# EAGLE design BIRDS_X_APRS_v2.7 (EAGLE 9.6.2)
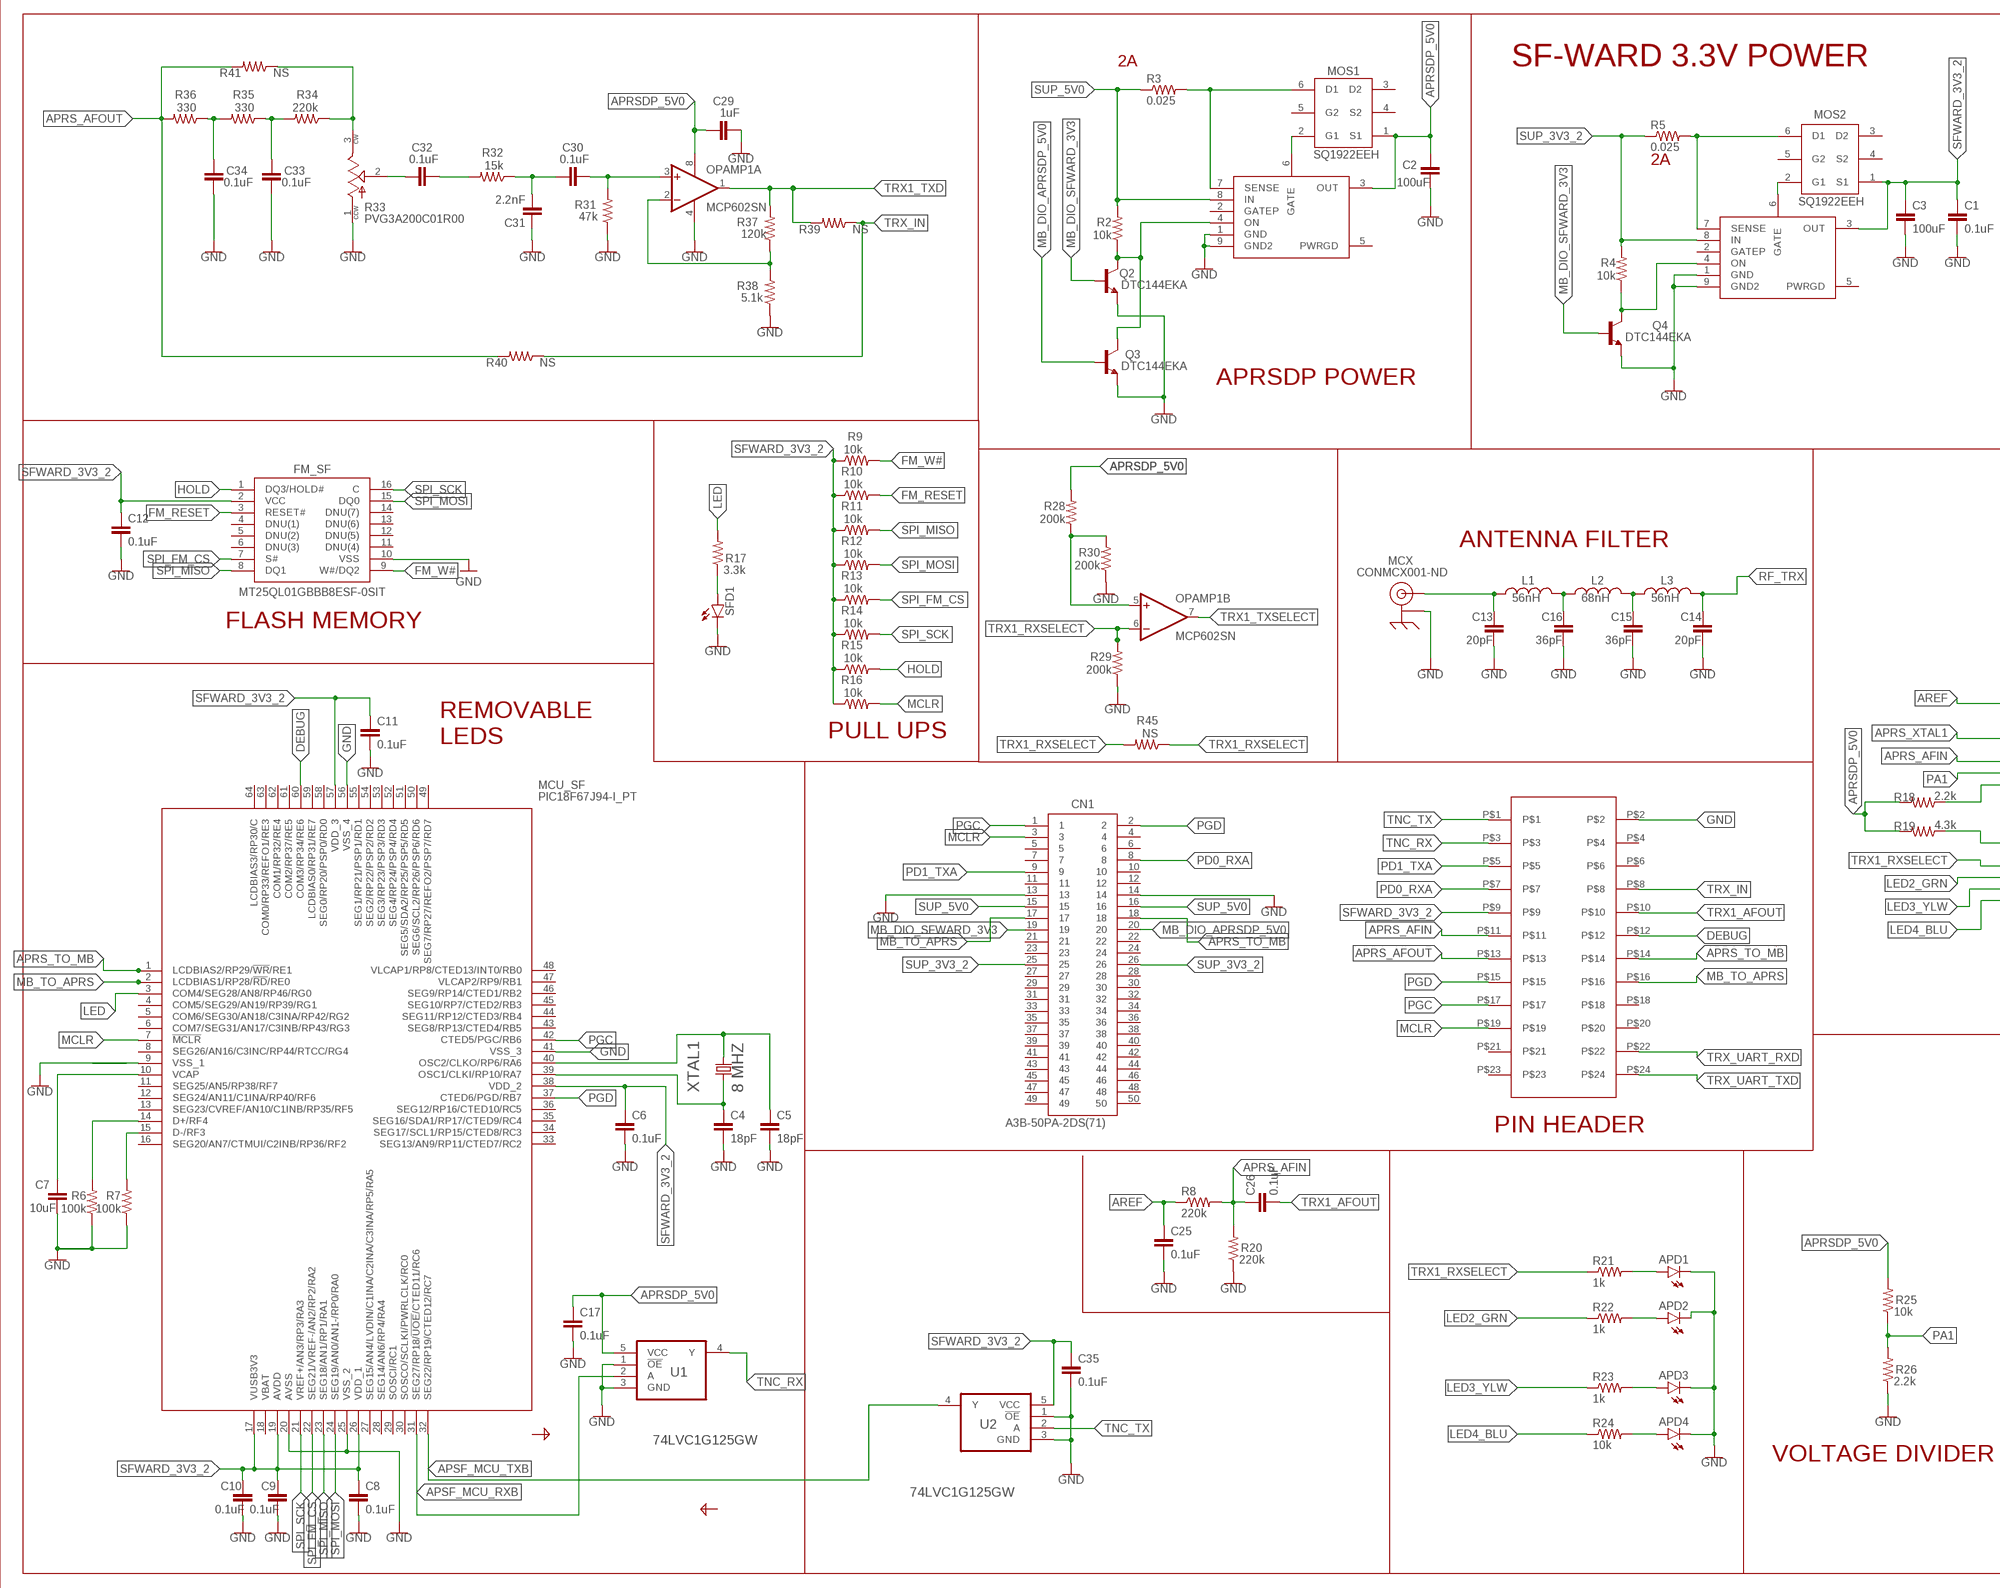
[diagram p0: schematic, sheet 1, part 1 of 2]
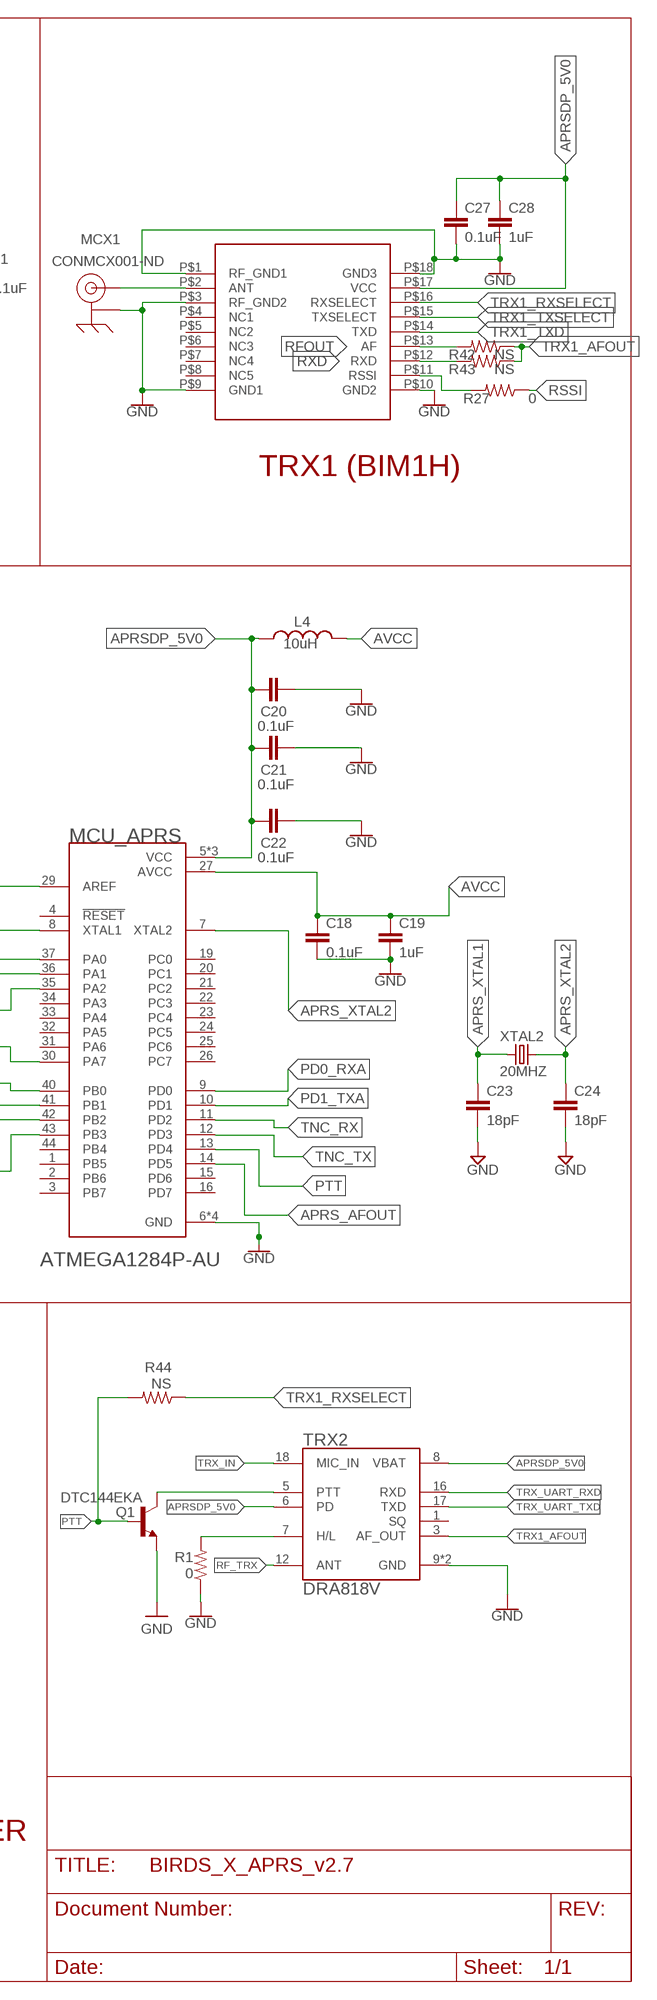
[diagram p1: schematic, sheet 1, part 2 of 2]

## Parts
APD1  LEDSML0603  [SML0603]
APD2  LEDSML0603  [SML0603]
APD3  LEDSML0603  [SML0603]
APD4  LEDSML0603  [SML0603]
C1  0.1uF  CAPACITOR  [M(1005)_US(0402)]
C2  100uF  CAPACITOR2012  [M(2012)_US(0805)]
C3  100uF  CAPACITOR2012  [M(2012)_US(0805)]
C4  18pF  CAPACITOR  [M(1005)_US(0402)]
C5  18pF  CAPACITOR  [M(1005)_US(0402)]
C6  0.1uF  CAPACITOR  [M(1005)_US(0402)]
C7  10uF  CAPACITOR1608  [M(1608)_US(0603)]
C8  0.1uF  CAPACITOR  [M(1005)_US(0402)]
C9  0.1uF  CAPACITOR  [M(1005)_US(0402)]
C10  0.1uF  CAPACITOR  [M(1005)_US(0402)]
C11  0.1uF  CAPACITOR  [M(1005)_US(0402)]
C12  0.1uF  CAPACITOR  [M(1005)_US(0402)]
C13  20pF  CAPACITOR1608  [M(1608)_US(0603)]
C14  20pF  CAPACITOR1608  [M(1608)_US(0603)]
C15  36pF  CAPACITOR1608  [M(1608)_US(0603)]
C16  36pF  CAPACITOR1608  [M(1608)_US(0603)]
C17  0.1uF  CAPACITOR  [M(1005)_US(0402)]
C18  0.1uF  CAPACITOR  [M(1005)_US(0402)]
C19  1uF  CAPACITOR  [M(1005)_US(0402)]
C20  0.1uF  CAPACITOR  [M(1005)_US(0402)]
C21  0.1uF  CAPACITOR  [M(1005)_US(0402)]
C22  0.1uF  CAPACITOR  [M(1005)_US(0402)]
C23  18pF  CAPACITOR  [M(1005)_US(0402)]
C24  18pF  CAPACITOR  [M(1005)_US(0402)]
C25  0.1uF  CAPACITOR  [M(1005)_US(0402)]
C26  0.1uF  CAPACITOR  [M(1005)_US(0402)]
C27  0.1uF  CAPACITOR  [M(1005)_US(0402)]
C28  1uF  CAPACITOR  [M(1005)_US(0402)]
C29  1uF  CAPACITOR  [M(1005)_US(0402)]
C30  0.1uF  CAPACITOR  [M(1005)_US(0402)]
C31  2.2nF  CAPACITOR  [M(1005)_US(0402)]
C32  0.1uF  CAPACITOR  [M(1005)_US(0402)]
C33  0.1uF  CAPACITOR  [M(1005)_US(0402)]
C34  0.1uF  CAPACITOR  [M(1005)_US(0402)]
C35  0.1uF  CAPACITOR  [M(1005)_US(0402)]
CN1  A3B-50PA-2DS(71)  [A3B-50PA-2DS(71)]
FM_SF  MT25QL01GBBB8ESF-0SIT  [SOIC127P1032X265-16N]
JP1  RAB_ACCESS  [RAB_ACCESS]
L1  56nH  INDUCTOR2012  [M(2012)_US(0805)]
L2  68nH  INDUCTOR2012  [M(2012)_US(0805)]
L3  56nH  INDUCTOR2012  [M(2012)_US(0805)]
L4  10uH  INDUCTOR2012  [M(2012)_US(0805)]
MCU_APRS  ATMEGA1284P-AU  [QFP80P1200X1200X120-44N]
MCU_SF  PIC18F67J94-I_PT  [QFP50P1200X1200X120-64N]
MCX  CONMCX001-ND  [CONMCX001-ND]
MCX1  CONMCX001-ND  [CONMCX001-ND]
MOS1  SQ1922EEH  [SOT65P210X110-6N]
MOS2  SQ1922EEH  [SOT65P210X110-6N]
OCP1  BIRDS5_LTC4361  [BIRDS5_LTC4361]
OCP2  BIRDS5_LTC4361  [BIRDS5_LTC4361]
OPAMP1  MCP602SN  [SO08]
Q1  DTC144EKA  [SOT346-R]
Q2  DTC144EKA  [SOT346-R]
Q3  DTC144EKA  [SOT346-R]
Q4  DTC144EKA  [SOT346-R]
R1  0  RESISTOR  [M(1005)_US(0402)]
R2  10k  RESISTOR  [M(1005)_US(0402)]
R3  0.025  RESISTOR2012  [M(2012)_US(0805)]
R4  10k  RESISTOR  [M(1005)_US(0402)]
R5  0.025  RESISTOR2012  [M(2012)_US(0805)]
R6  100k  RESISTOR  [M(1005)_US(0402)]
R7  100k  RESISTOR  [M(1005)_US(0402)]
R8  220k  RESISTOR1608  [M(1608)_US(0603)]
R9  10k  RESISTOR  [M(1005)_US(0402)]
R10  10k  RESISTOR  [M(1005)_US(0402)]
R11  10k  RESISTOR  [M(1005)_US(0402)]
R12  10k  RESISTOR  [M(1005)_US(0402)]
R13  10k  RESISTOR  [M(1005)_US(0402)]
R14  10k  RESISTOR  [M(1005)_US(0402)]
R15  10k  RESISTOR  [M(1005)_US(0402)]
R16  10k  RESISTOR  [M(1005)_US(0402)]
R17  3.3k  RESISTOR1608  [M(1608)_US(0603)]
R18  2.2k  RESISTOR  [M(1005)_US(0402)]
R19  4.3k  RESISTOR  [M(1005)_US(0402)]
R20  220k  RESISTOR1608  [M(1608)_US(0603)]
R21  1k  RESISTOR1608  [M(1608)_US(0603)]
R22  1k  RESISTOR1608  [M(1608)_US(0603)]
R23  1k  RESISTOR1608  [M(1608)_US(0603)]
R24  10k  RESISTOR1608  [M(1608)_US(0603)]
R25  10k  RESISTOR1608  [M(1608)_US(0603)]
R26  2.2k  RESISTOR1608  [M(1608)_US(0603)]
R27  0  RESISTOR1608  [M(1608)_US(0603)]
R28  200k  RESISTOR  [M(1005)_US(0402)]
R29  200k  RESISTOR  [M(1005)_US(0402)]
R30  200k  RESISTOR  [M(1005)_US(0402)]
R31  47k  RESISTOR1608  [M(1608)_US(0603)]
R32  15k  RESISTOR1608  [M(1608)_US(0603)]
R33  PVG3A200C01R00  [TRIM_PVG3A200C01R00]
R34  220k  RESISTOR1608  [M(1608)_US(0603)]
R35  330  RESISTOR1608  [M(1608)_US(0603)]
R36  330  RESISTOR1608  [M(1608)_US(0603)]
R37  120k  RESISTOR1608  [M(1608)_US(0603)]
R38  5.1k  RESISTOR1608  [M(1608)_US(0603)]
R39  NS  RESISTOR1608  [M(1608)_US(0603)]
R40  NS  RESISTOR1608  [M(1608)_US(0603)]
R41  NS  RESISTOR1608  [M(1608)_US(0603)]
R42  NS  RESISTOR1608  [M(1608)_US(0603)]
R43  NS  RESISTOR1608  [M(1608)_US(0603)]
R44  NS  RESISTOR1608  [M(1608)_US(0603)]
R45  NS  RESISTOR1608  [M(1608)_US(0603)]
SFD1  LEDCHIPLED_0603  [CHIPLED_0603]
TRX1  BIM1H  [BIM1H]
TRX2  DRA818V  [DORJI_DRA818V]
U1  74LVC1G125GW  [SOT65P210X110-5N]
U2  74LVC1G125GW  [SOT65P210X110-5N]
XTAL1  8 MHZ  CRYSTAL_CRYSTALSM49  [CRYSTAL_SM49]
XTAL2  20MHZ  CRYSTALSM49  [SM49]

## Nets
APRS_AFIN: C26.1 JP1.P$11 MCU_APRS.37(PA0) R8.2 R20.2
APRS_AFOUT: JP1.P$13 MCU_APRS.14(PD5) R36.2 R40.2 R41.2
APRS_TO_MB: CN1.18 JP1.P$14 MCU_SF.1(LCDBIAS2/RP29/!WR!/RE1)
APRS_XTAL1: C23.1 MCU_APRS.8(XTAL1) XTAL2.1
APRS_XTAL2: C24.1 MCU_APRS.7(XTAL2) XTAL2.2
APRSDP_5V0: C2.1 C17.1 C20.1 C21.1 C22.1 C27.1 C28.1 C29.1 L4.1 MCU_APRS.5(VCC) MCU_APRS.17(VCC) MCU_APRS.38(VCC) MOS1.1(S1) OCP1.3(OUT) OPAMP1.8(P:V+) R18.2 R19.2 R25.2 R28.2 TRX1.P$17(VCC) TRX2.6(PD) TRX2.8(VBAT) U1.5(VCC)
APSF_MCU_RXB: MCU_SF.31(SEG27/RP18/!UOE!/CTED11/RC6) U1.2(A)
APSF_MCU_TXB: MCU_SF.32(SEG22/RP19/CTED12/RC7) U2.4(Y)
AREF: C25.1 MCU_APRS.29(AREF) R8.1
AVCC: C18.1 C19.1 L4.2 MCU_APRS.27(AVCC)
DEBUG: JP1.P$12 MCU_SF.60(COM3/RP34/RE6)
FM_RESET: FM_SF.3(RESET#) R10.2
FM_W#: FM_SF.9(W#/DQ2) R9.2
GATE3: MOS2.2(G1) OCP2.6(GATE)
GND: APD1.C APD2.C APD3.C APD4.C C1.2 C2.2 C3.2 C4.2 C5.2 C6.2 C7.2 C8.2 C9.2 C10.2 C11.2 C12.2 C13.2 C14.2 C15.2 C16.2 C17.2 C18.2 C19.2 C20.2 C21.2 C22.2 C23.2 C24.2 C25.2 C27.2 C28.2 C29.2 C31.1 C33.2 C34.2 C35.2 CN1.13 CN1.14 FM_SF.10(VSS) JP1.P$2 MCU_APRS.6(GND) MCU_APRS.18(GND) MCU_APRS.28(GND) MCU_APRS.39(GND) MCU_SF.9(VSS_1) MCU_SF.20(AVSS) MCU_SF.25(VSS_2) MCU_SF.41(VSS_3) MCU_SF.56(VSS_4) MCX1.2 MCX1.3 MCX1.4 MCX1.5 MCX.2 MCX.3 MCX.4 MCX.5 OCP1.1(GND) OCP1.9(GND2) OCP2.1(GND) OCP2.9(GND2) OPAMP1.4(P:V-) Q1.1(E) Q2.1(E) Q3.1(E) Q4.1(E) R1.1 R20.1 R26.1 R30.1 R31.1 R33.1(CCW) R38.1 TRX1.P$1(RF_GND1) TRX1.P$3(RF_GND2) TRX1.P$9(GND1) TRX1.P$10(GND2) TRX1.P$18(GND3) TRX2.9(GND) TRX2.10(GND) U1.1(!OE) U1.3(GND) U2.1(!OE) U2.3(GND)
HOLD: FM_SF.1(DQ3/HOLD#) R15.2
LED: MCU_SF.3(COM4/SEG28/AN8/RP46/RG0) R17.2
LED2_GREEN: APD2.A R22.2
LED2_GRN: MCU_APRS.41(PB1) R22.1
LED3_YLW: MCU_APRS.42(PB2) R23.1
LED4_BLU: MCU_APRS.43(PB3) R24.1
LED4_BLUE: APD4.A R24.2
LED_3_YELLOW: APD3.A R23.2
MB_DIO_APRSDP_5V0: CN1.20 Q3.2(B)
MB_DIO_SFWARD_3V3: CN1.19 Q2.2(B) Q4.2(B)
MB_TO_APRS: CN1.17 JP1.P$16 MCU_SF.2(LCDBIAS1/RP28/!RD!/RE0)
MCLR: CN1.3 JP1.P$19 MCU_SF.7(!MCLR) R16.2
N$1: MOS1.2(G1) OCP1.6(GATE)
N$2: C7.1 MCU_SF.10(VCAP)
N$3: C5.1 MCU_SF.40(OSC2/CLKO/RP6/RA6) XTAL1.2
N$4: MCU_SF.15(D-/RF3) R7.2
N$5: MCU_SF.14(D+/RF4) R6.2
N$6: R17.1 SFD1.A
N$7: C15.1 L2.2 L3.1
N$8: C16.1 L1.2 L2.1
N$10: C13.1 L1.1 MCX.1
N$12: R1.2 TRX2.7(H/L)
N$13: MCU_APRS.35(PA2) R18.1
N$14: MCU_APRS.30(PA7) R19.1
N$15: R27.2 TRX1.P$11(RSSI)
N$16: MCX1.1 TRX1.P$2(ANT)
N$17: OPAMP1.5(B:+IN) R28.1 R30.2
N$19: C32.2 R32.2
N$20: C30.1 C31.2 R32.1
N$21: C30.2 OPAMP1.3(A:+IN) R31.2
N$22: Q1.3(C) TRX2.5(PTT)
N$23: C32.1 R33.2(WIPER)
N$24: R33.3(CW) R34.1 R41.1
N$25: C34.1 R35.2 R36.1
N$26: C33.1 R34.2 R35.1
N$27: OPAMP1.2(A:-IN) R37.1 R38.2
ON3: OCP2.4(ON) Q4.3(C) R4.1
ON4: OCP1.4(ON) Q2.3(C) Q3.3(C) R2.1
OSC2: C4.1 MCU_SF.39(OSC1/CLKI/RP10/RA7) XTAL1.1
PA1: MCU_APRS.36(PA1) R25.1 R26.2
PD0_RXA: CN1.8 JP1.P$7 MCU_APRS.9(PD0)
PD1_TXA: CN1.9 JP1.P$5 MCU_APRS.10(PD1)
PGC: CN1.1 JP1.P$17 MCU_SF.42(CTED5/PGC/RB6)
PGD: CN1.2 JP1.P$15 MCU_SF.37(CTED6/PGD/RB7)
PTT: MCU_APRS.13(PD4) Q1.2(B) R44.2
RF_TRX: C14.1 L3.2 TRX2.12(ANT)
RFOUT: R42.2 TRX1.P$13(AF)
RSSI: R27.1
RXD: R43.2 TRX1.P$12(RXD)
SENSE3: MOS2.6(D1) OCP2.7(SENSE) R5.2
SENSE4: MOS1.6(D1) OCP1.7(SENSE) R3.2
SFWARD_3V3_2: C1.1 C3.1 C6.1 C8.1 C9.1 C10.1 C11.1 C12.1 C35.1 FM_SF.2(VCC) JP1.P$9 MCU_SF.17(VUSB3V3) MCU_SF.19(AVDD) MCU_SF.26(VDD_1) MCU_SF.38(VDD_2) MCU_SF.57(VDD_3) MOS2.1(S1) OCP2.3(OUT) R9.1 R10.1 R11.1 R12.1 R13.1 R14.1 R15.1 R16.1 U2.5(VCC)
SPI_FM_CS: FM_SF.7(S#) MCU_SF.22(SEG21/VREF-/AN2/RP2/RA2) R13.2
SPI_MISO: FM_SF.8(DQ1) MCU_SF.23(SEG18/AN1/RP1/RA1) R11.2
SPI_MOSI: FM_SF.15(DQ0) MCU_SF.24(SEG19/AN0/AN1-/RP0/RA0) R12.2
SPI_SCK: FM_SF.16(C) MCU_SF.21(VREF+/AN3/RP3/RA3) R14.2
SUP_3V3_2: CN1.25 CN1.26 OCP2.8(IN) R4.2 R5.1
SUP_5V0: CN1.15 CN1.16 OCP1.8(IN) R2.2 R3.1
TNC_RX: JP1.P$3 MCU_APRS.11(PD2) U1.4(Y)
TNC_TX: JP1.P$1 MCU_APRS.12(PD3) U2.2(A)
TRX1_AFOUT: C26.2 JP1.P$10 R42.1 R43.1 TRX2.3(AF_OUT)
TRX1_RX_LED: APD1.A R21.2
TRX1_RXSELECT: MCU_APRS.40(PB0) OPAMP1.6(B:-IN) R21.1 R29.2 R44.1 R45.1 R45.2 TRX1.P$16(RXSELECT)
TRX1_TXD: OPAMP1.1(A:OUT) R37.2 R39.2 TRX1.P$14(TXD)
TRX1_TXSELECT: OPAMP1.7(B:OUT) TRX1.P$15(TXSELECT)
TRX_IN: JP1.P$8 R39.1 R40.1 TRX2.18(MIC_IN)
TRX_UART_RXD: JP1.P$22 TRX2.16(RXD)
TRX_UART_TXD: JP1.P$24 TRX2.17(TXD)
Unconnected: CN1.4 CN1.5 CN1.6 CN1.7 CN1.10 CN1.11 CN1.12 CN1.21 CN1.22 CN1.23 CN1.24 CN1.27 CN1.28 CN1.29 CN1.30 CN1.31 CN1.32 CN1.33 CN1.34 CN1.35 CN1.36 CN1.37 CN1.38 CN1.39 CN1.40 CN1.41 CN1.42 CN1.43 CN1.44 CN1.45 CN1.46 CN1.47 CN1.48 CN1.49 CN1.50 FM_SF.4(DNU(1)) FM_SF.5(DNU(2)) FM_SF.6(DNU(3)) FM_SF.11(DNU(4)) FM_SF.12(DNU(5)) FM_SF.13(DNU(6)) FM_SF.14(DNU(7)) JP1.P$4 JP1.P$6 JP1.P$18 JP1.P$20 JP1.P$21 JP1.P$23 MCU_APRS.1(PB5) MCU_APRS.2(PB6) MCU_APRS.3(PB7) MCU_APRS.4(!RESET) MCU_APRS.15(PD6) MCU_APRS.16(PD7) MCU_APRS.19(PC0) MCU_APRS.20(PC1) MCU_APRS.21(PC2) MCU_APRS.22(PC3) MCU_APRS.23(PC4) MCU_APRS.24(PC5) MCU_APRS.25(PC6) MCU_APRS.26(PC7) MCU_APRS.31(PA6) MCU_APRS.32(PA5) MCU_APRS.33(PA4) MCU_APRS.34(PA3) MCU_APRS.44(PB4) MCU_SF.4(COM5/SEG29/AN19/RP39/RG1) MCU_SF.5(COM6/SEG30/AN18/C3INA/RP42/RG2) MCU_SF.6(COM7/SEG31/AN17/C3INB/RP43/RG3) MCU_SF.8(SEG26/AN16/C3INC/RP44/RTCC/RG4) MCU_SF.11(SEG25/AN5/RP38/RF7) MCU_SF.12(SEG24/AN11/C1INA/RP40/RF6) MCU_SF.13(SEG23/CVREF/AN10/C1INB/RP35/RF5) MCU_SF.16(SEG20/AN7/CTMUI/C2INB/RP36/RF2) MCU_SF.18(VBAT) MCU_SF.27(SEG15/AN4/LVDIN/C1INA/C2INA/C3INA/RP5/RA5) MCU_SF.28(SEG14/AN6/RP4/RA4) MCU_SF.29(SOSCI/RC1) MCU_SF.30(SOSCO/SCLKI/PWRLCLK/RC0) MCU_SF.33(SEG13/AN9/RP11/CTED7/RC2) MCU_SF.34(SEG17/SCL1/RP15/CTED8/RC3) MCU_SF.35(SEG16/SDA1/RP17/CTED9/RC4) MCU_SF.36(SEG12/RP16/CTED10/RC5) MCU_SF.43(SEG8/RP13/CTED4/RB5) MCU_SF.44(SEG11/RP12/CTED3/RB4) MCU_SF.45(SEG10/RP7/CTED2/RB3) MCU_SF.46(SEG9/RP14/CTED1/RB2) MCU_SF.47(VLCAP2/RP9/RB1) MCU_SF.48(VLCAP1/RP8/CTED13/INT0/RB0) MCU_SF.49(SEG7/RP27/REFO2/PSP7/RD7) MCU_SF.50(SEG6/SCL2/RP26/PSP6/RD6) MCU_SF.51(SEG5/SDA2/RP25/PSP5/RD5) MCU_SF.52(SEG4/RP24/PSP4/RD4) MCU_SF.53(SEG3/RP23/PSP3/RD3) MCU_SF.54(SEG2/RP22/PSP2/RD2) MCU_SF.55(SEG1/RP21/PSP1/RD1) MCU_SF.58(SEG0/RP20/PSP0/RD0) MCU_SF.59(LCDBIAS0/RP31/RE7) MCU_SF.61(COM2/RP37/RE5) MCU_SF.62(COM1/RP32/RE4) MCU_SF.63(COM0/RP33/REFO1/RE3) MCU_SF.64(LCDBIAS3/RP30/C) MOS1.3(D2) MOS1.4(S2) MOS1.5(G2) MOS2.3(D2) MOS2.4(S2) MOS2.5(G2) OCP1.2(GATEP) OCP1.5(PWRGD) OCP2.2(GATEP) OCP2.5(PWRGD) R6.1 R7.1 R29.1 SFD1.C TRX1.P$4(NC1) TRX1.P$5(NC2) TRX1.P$6(NC3) TRX1.P$7(NC4) TRX1.P$8(NC5) TRX2.1(SQ)

## Notes on the sheet
- 2A | SF-WARD 3.3V POWER
- 2A
- TRX1 (BIM1H)
- APRSDP POWER
- ANTENNA FILTER
- FLASH MEMORY
- PULL UPS
- REMOVABLE
  LEDS
- PIN HEADER
- VOLTAGE DIVIDER

## Library data of the parts
APD1-APD4 SFD1 = led:LED: LED OSRAM: - CHIPLED LG R971, LG N971, LY N971, LG Q971, LY Q971, LO R971, LY R971 LH N974, LH R974 LS Q976, LO Q976, LY Q976 LO Q996 - Hyper CHIPLED LW Q18S LB Q993, LB Q99A, LB R99A - SideLED LS A670, LO A670, LY A670, LG A670, LP A670 LB A673, LV A673, LT A673, LW A673 LH A674 LY A675 LS A676, LA A676, LO A676, LY A676, LW A676 LS A679, LY A679, LG A679 - Hyper Micro SIDELED® LS Y876, LA Y876, LO Y876, LY Y876 LT Y87S - SmartLED LW L88C, LW L88S LB L89C, LB L89S, LG L890 LS L89K, LO L89K, LY L89K LS L896, LA L896, LO L896, LY L896 - TOPLED LS T670, LO T670, LY T670, LG T670, LP T670 LSG T670, LSP T670, LSY T670, LOP T670, LYG T670 LG T671, LOG T671, LSG T671 LB T673, LV T673, LT T673, LW T673 LH T674 LS T676, LA T676, LO T676, LY T676, LB T676, LH T676, LSB T676, LW T676 LB T67C, LV T67C, LT T67C, LS T67K, LO T67K, LY T67K, LW E67C LS E67B, LA E67B, LO E67B, LY E67B, LB E67C, LV E67C, LT E67C LW T67C LS T679, LY T679, LG T679 LS T770, LO T770, LY T770, LG T770, LP T770 LB T773, LV T773, LT T773, LW T773 LH T774 LS E675, LA E675, LY E675, LS T675 LS T776, LA T776, LO T776, LY T776, LB T776 LHGB T686 LT T68C, LB T68C - Hyper Mini TOPLED® LB M676 - Mini TOPLED Santana® LG M470 LS M47K, LO M47K, LY M47K Source: http://www.osram.convergy.de LUXEON: - LUMILED® LXK2-PW12-R00, LXK2-PW12-S00, LXK2-PW14-U00, LXK2-PW14-V00 LXK2-PM12-R00, LXK2-PM12-S00, LXK2-PM14-U00 LXK2-PE12-Q00, LXK2-PE12-R00, LXK2-PE12-S00, LXK2-PE14-T00, LXK2-PE14-U00 LXK2-PB12-K00, LXK2-PB12-L00, LXK2-PB12-M00, LXK2-PB14-N00, LXK2-PB14-P00, LXK2-PB14-Q00 LXK2-PR12-L00, LXK2-PR12-M00, LXK2-PR14-Q00, LXK2-PR14-R00 LXK2-PD12-Q00, LXK2-PD12-R00, LXK2-PD12-S00 LXK2-PH12-R00, LXK2-PH12-S00 LXK2-PL12-P00, LXK2-PL12-Q00, LXK2-PL12-R00 Source: www.luxeon.com KINGBRIGHT: KA-3528ASYC Source: www.kingbright.com
C1-C35 = Tharindu_lib:CAPACITOR
CN1 = Tharindu1:A3B-50PA-2DS(71)
FM_SF = BIRDS3_CAM_MSN:MT25QL01GBBB8ESF-0SIT: IC FLASH 1GBIT 108MHZ 16SOIC Source: Datasheet <https://www.micron.com/~/media/documents/products/data-sheet/nor-flash/serial-nor/mt25q/die-rev-b/mt25q_qlkt_l_01g_bbb_0.pdf>; DESCRIPTION: IC FLASH 1GBIT 108MHZ 16SOIC; HEIGHT: 2.65mm; MANUFACTURER_NAME: Micron; MANUFACTURER_PART_NUMBER: MT25QL01GBBB8ESF-0SIT; SUPPLIER_NAME: RS
JP1 = BIRDS_4_general_components_library:RAB_ACCESS
L1-L4 = Tharindu_lib:INDUCTOR
MCU_APRS = ATMEGA1284P-AU:ATMEGA1284P-AU: ATmega Series 20 MHz 128 KB Flash 16 KB SRAM 8-Bit Microcontroller - TQFP-44 Check availability <https://pricing.snapeda.com/parts/ATMEGA1284P-AU/Microchip/view-part?ref=eda>; AVAILABILITY: In Stock; DESCRIPTION: AVR AVR® ATmega Microcontroller IC 8-Bit 20MHz 128KB (64K x 16) FLASH 44-TQFP (10x10); MF: Microchip; MP: ATMEGA1284P-AU; PACKAGE: TQFP-44 Microchip; PRICE: None; PURCHASE-URL: https://pricing.snapeda.com/search/part/ATMEGA1284P-AU/?ref=eda
MCU_SF = PIC18F67J94-I_PT:PIC18F67J94-I_PT: MCU 8-Bit 128K Flash LCD USB XLP TQFP64 Microchip PIC18F67J94-I/PT, 8bit PIC Microcontroller, 64MHz, 128 kB Flash, 64-Pin TQFP Source: Datasheet <http://uk.rs-online.com/web/p/products/8233908>; ALLIED_NUMBER: 70470236; ALLIED_PRICE-STOCK: https://www.alliedelec.com/microchip-technology-inc-pic18f67j94-i-pt/70470236/; DESCRIPTION: MCU 8-Bit 128K Flash LCD USB XLP TQFP64 Microchip PIC18F67J94-I/PT, 8bit PIC Microcontroller, 64MHz, 128 kB Flash, 64-Pin TQFP; HEIGHT: 1.2mm; MANUFACTURER_NAME: Microchip; MANUFACTURER_PART_NUMBER: PIC18F67J94-I/PT; MOUSER_PART_NUMBER: 579-PIC18F67J94-I/PT; MOUSER_PRICE-STOCK: https://www.mouser.com/Search/Refine.aspx?Keyword=579-PIC18F67J94-I%2FPT; RS_PART_NUMBER: 1652172; RS_PRICE-STOCK: http://uk.rs-online.com/web/p/products/1652172
MCX MCX1 = Tharindu:CONMCX001-ND
MOS1 MOS2 = BIRDS3_CAM_MSN:SQ1922EEH
OCP1 OCP2 = BIRDS5_LTC4361:BIRDS5_LTC4361
OPAMP1 = linear:MCP602: Single Op Amp 2.7V to 6.0V Single Supply CMOS Source: http://ww1.microchip.com/downloads/en/DeviceDoc/21314g.pdf
Q1-Q4 = BIRDS3_CAM_MSN:DTC144EKA
R1-R32 R34-R45 = Tharindu_lib:RESISTOR
R33 = PVG3A200C01R00:PVG3A200C01R00: Res Cermet Trimmer 20 Ohm 20% 1/4W 1(Elec)/1(Mech)Turn 2.2mm (3.6 X 3.6 X 2mm) J-Hook SMD T/R; DESCRIPTION: Trimmer 20 Ohm 0.25w Smd; DIGI-KEY_PART_NUMBER: 490-2647-1-ND; DIGI-KEY_PURCHASE_URL: https://www.digikey.jp/product-detail/en/bourns-inc/PVG3A200C01R00/490-2647-1-ND/666223?utm_source=snapeda&utm_medium=aggregator&utm_campaign=symbol; MF: Bourns; MP: PVG3A200C01R00; PACKAGE: TO-221 Bourns
TRX1 = BIRDS_4_general_components_library:BIM1H
TRX2 = DRA818V:DRA818V: VHF Band Voice Transceiver Module Check availability <https://pricing.snapeda.com/parts/DRA818V/DORJI/view-part?ref=eda>; AVAILABILITY: Not in stock; MF: DORJI; MP: DRA818V; PACKAGE: Package; PRICE: None
U1 U2 = 74LVC1G125GW(1):74LVC1G125GW: Bus buffer/line driver 3-state Check availability <https://pricing.snapeda.com/parts/74LVC1G125GW/NXP%20Semiconductors/view-part?ref=eda>; AVAILABILITY: Not in stock; CHECK_PRICES: https://www.snapeda.com/parts/74LVC1G125GW/NXP+Semiconductors/view-part/?ref=eda; DESCRIPTION: Buffer, Non-Inverting 1 Element 1 Bit per Element 3-State Output 5-TSSOP; MF: NXP Semiconductors; MP: 74LVC1G125GW; PACKAGE: SOT-353 NXP Semiconductors; PRICE: None; SNAPEDA_LINK: https://www.snapeda.com/parts/74LVC1G125GW/NXP+Semiconductors/view-part/?ref=snap
XTAL1 = Schematic SF FM v1.26:CRYSTAL_CRYSTAL: CRYSTAL; OC_FARNELL: unknown; OC_NEWARK: unknown
XTAL2 = crystal:CRYSTAL: CRYSTAL; OC_FARNELL: unknown; OC_NEWARK: unknown

## Board
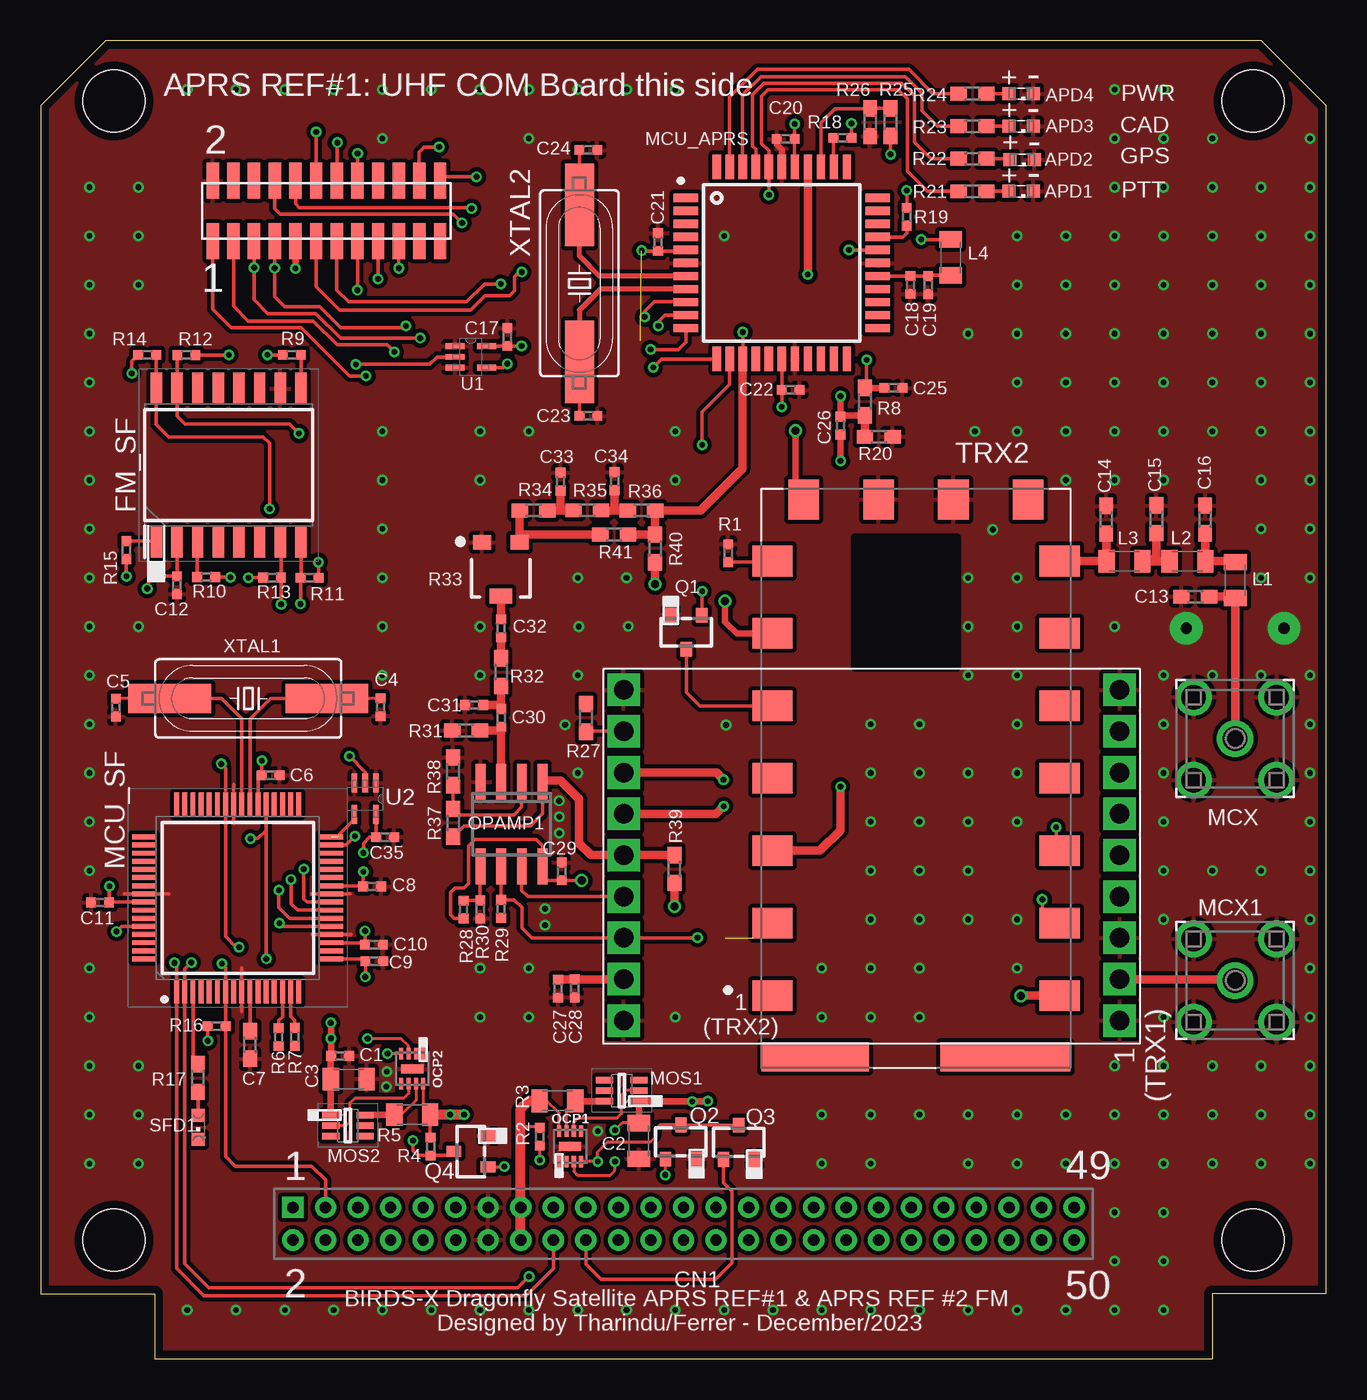
[diagram p2: board, top side]
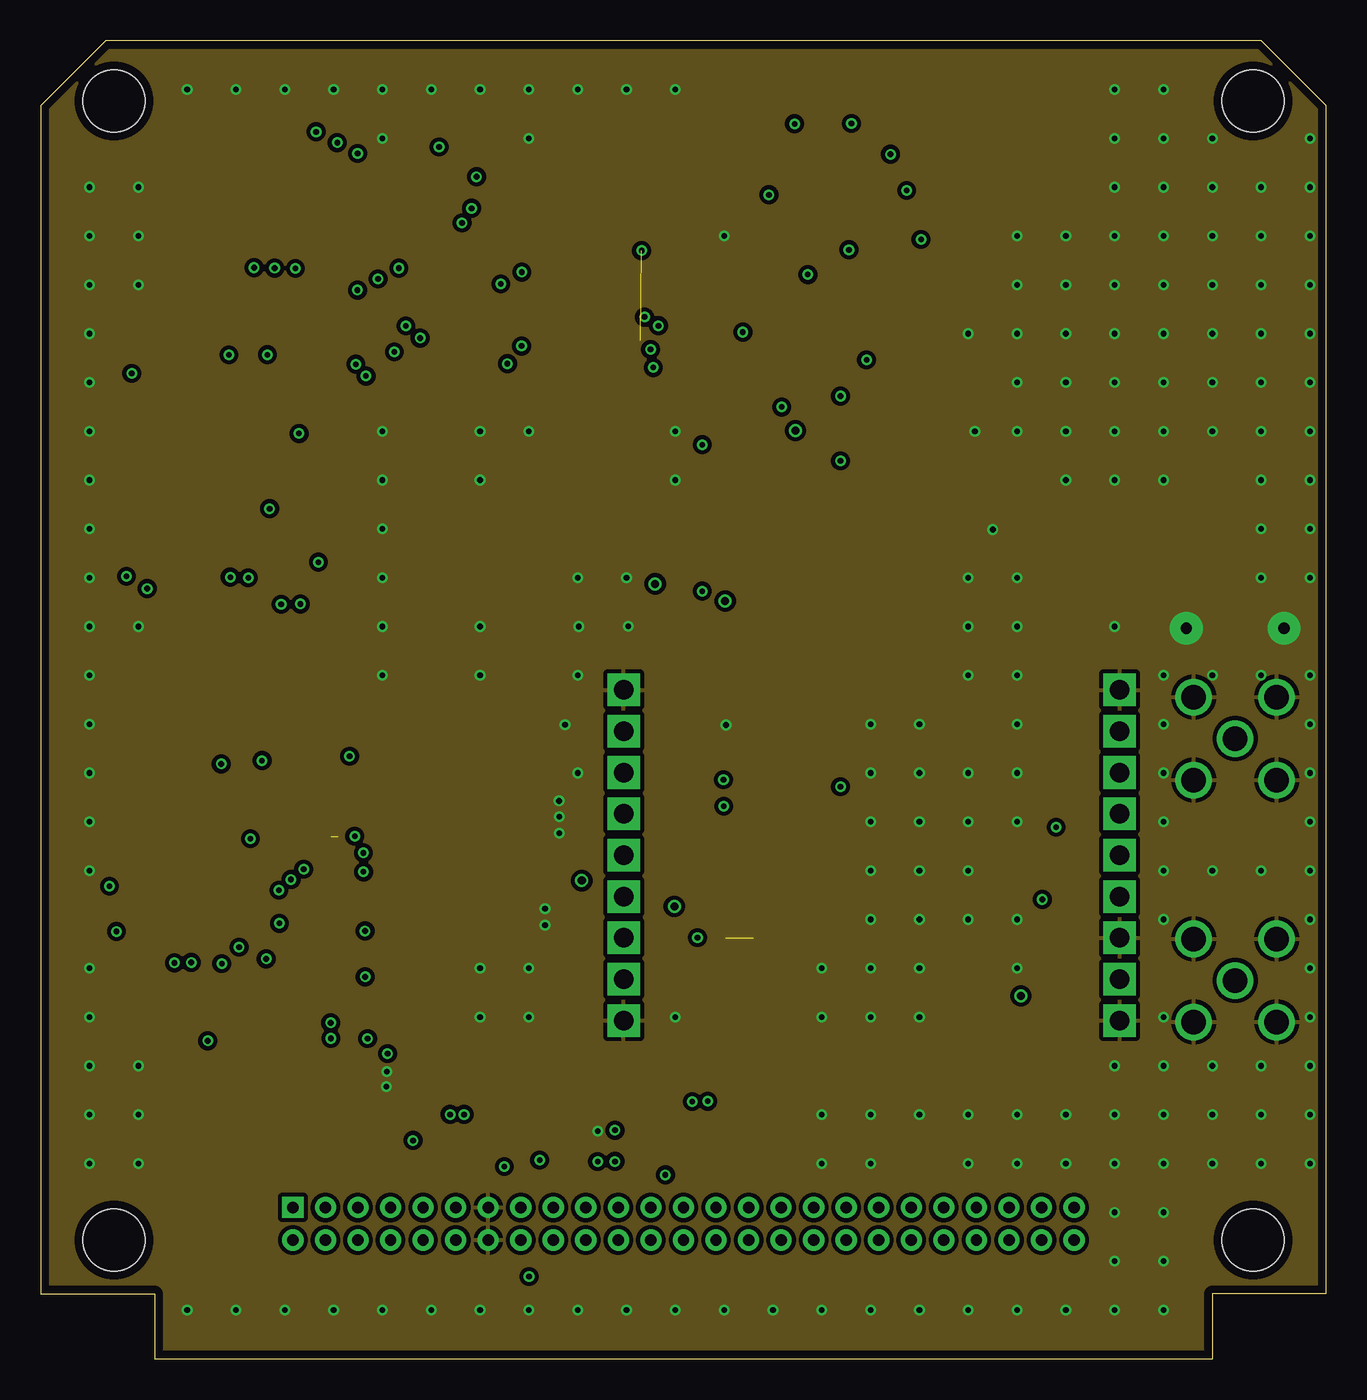
[diagram p3: board, inner layer Route2]
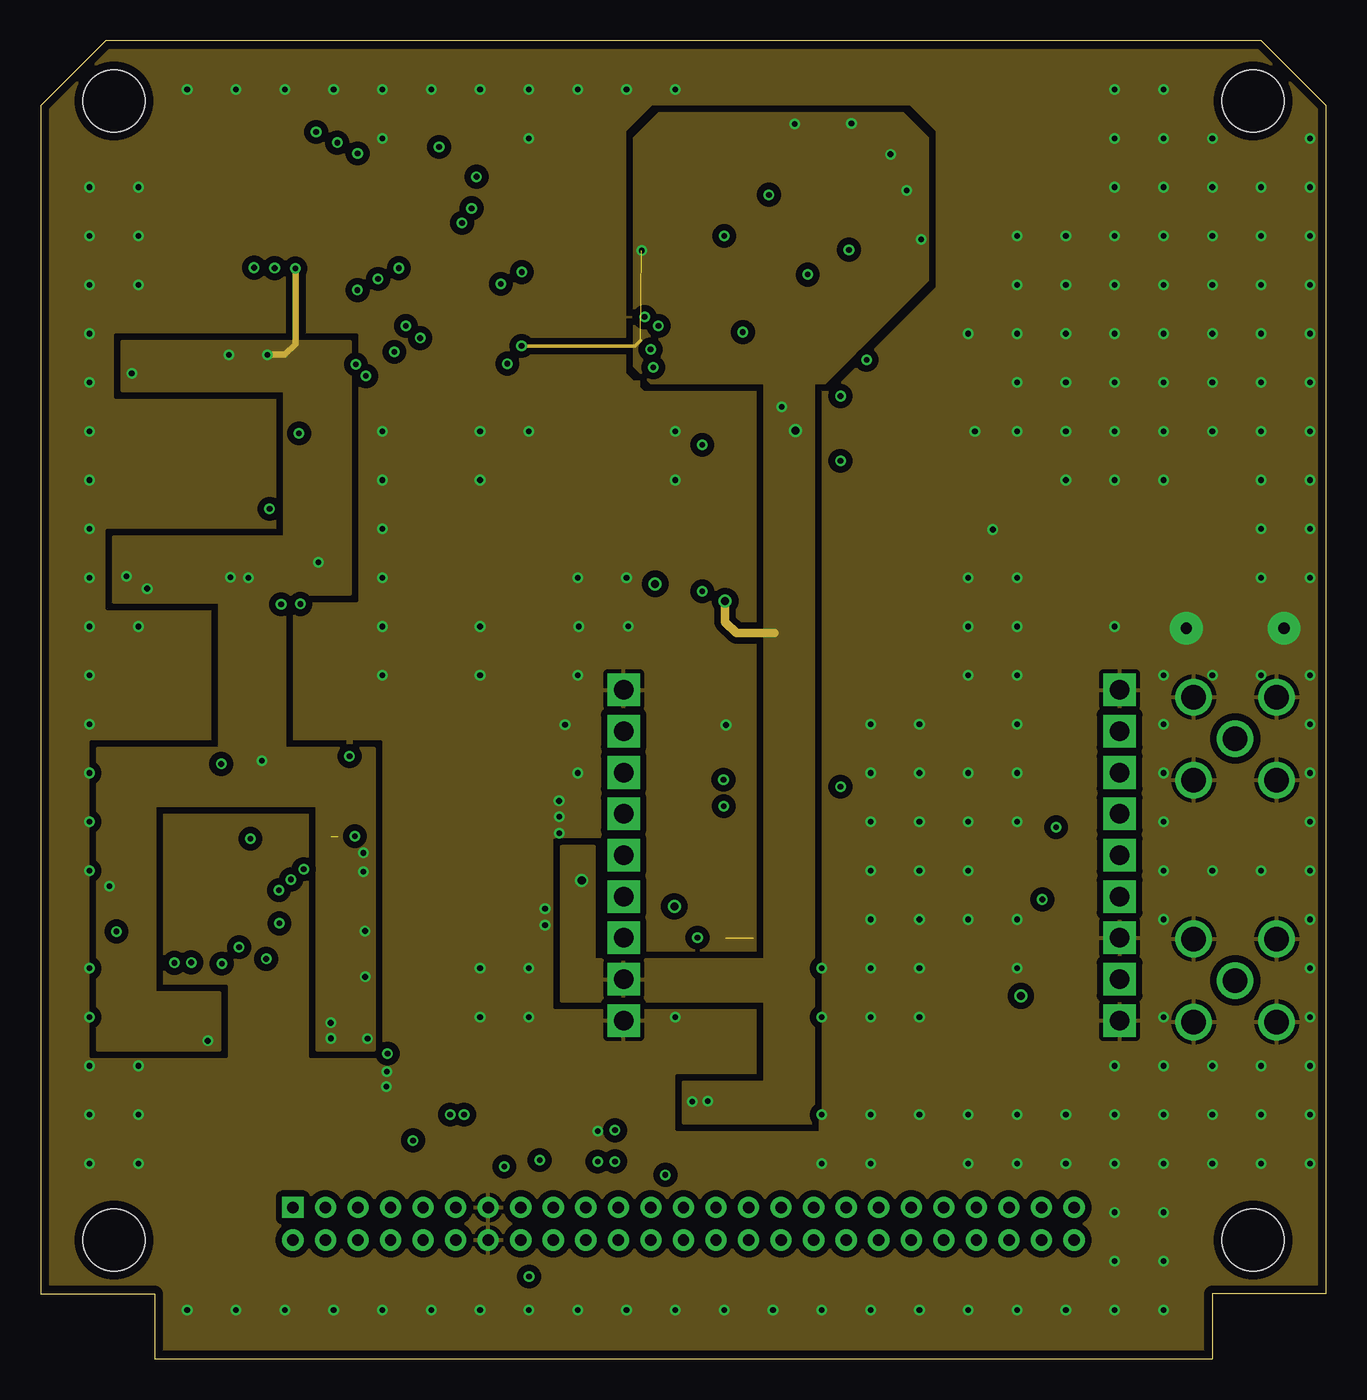
[diagram p4: board, inner layer Route15]
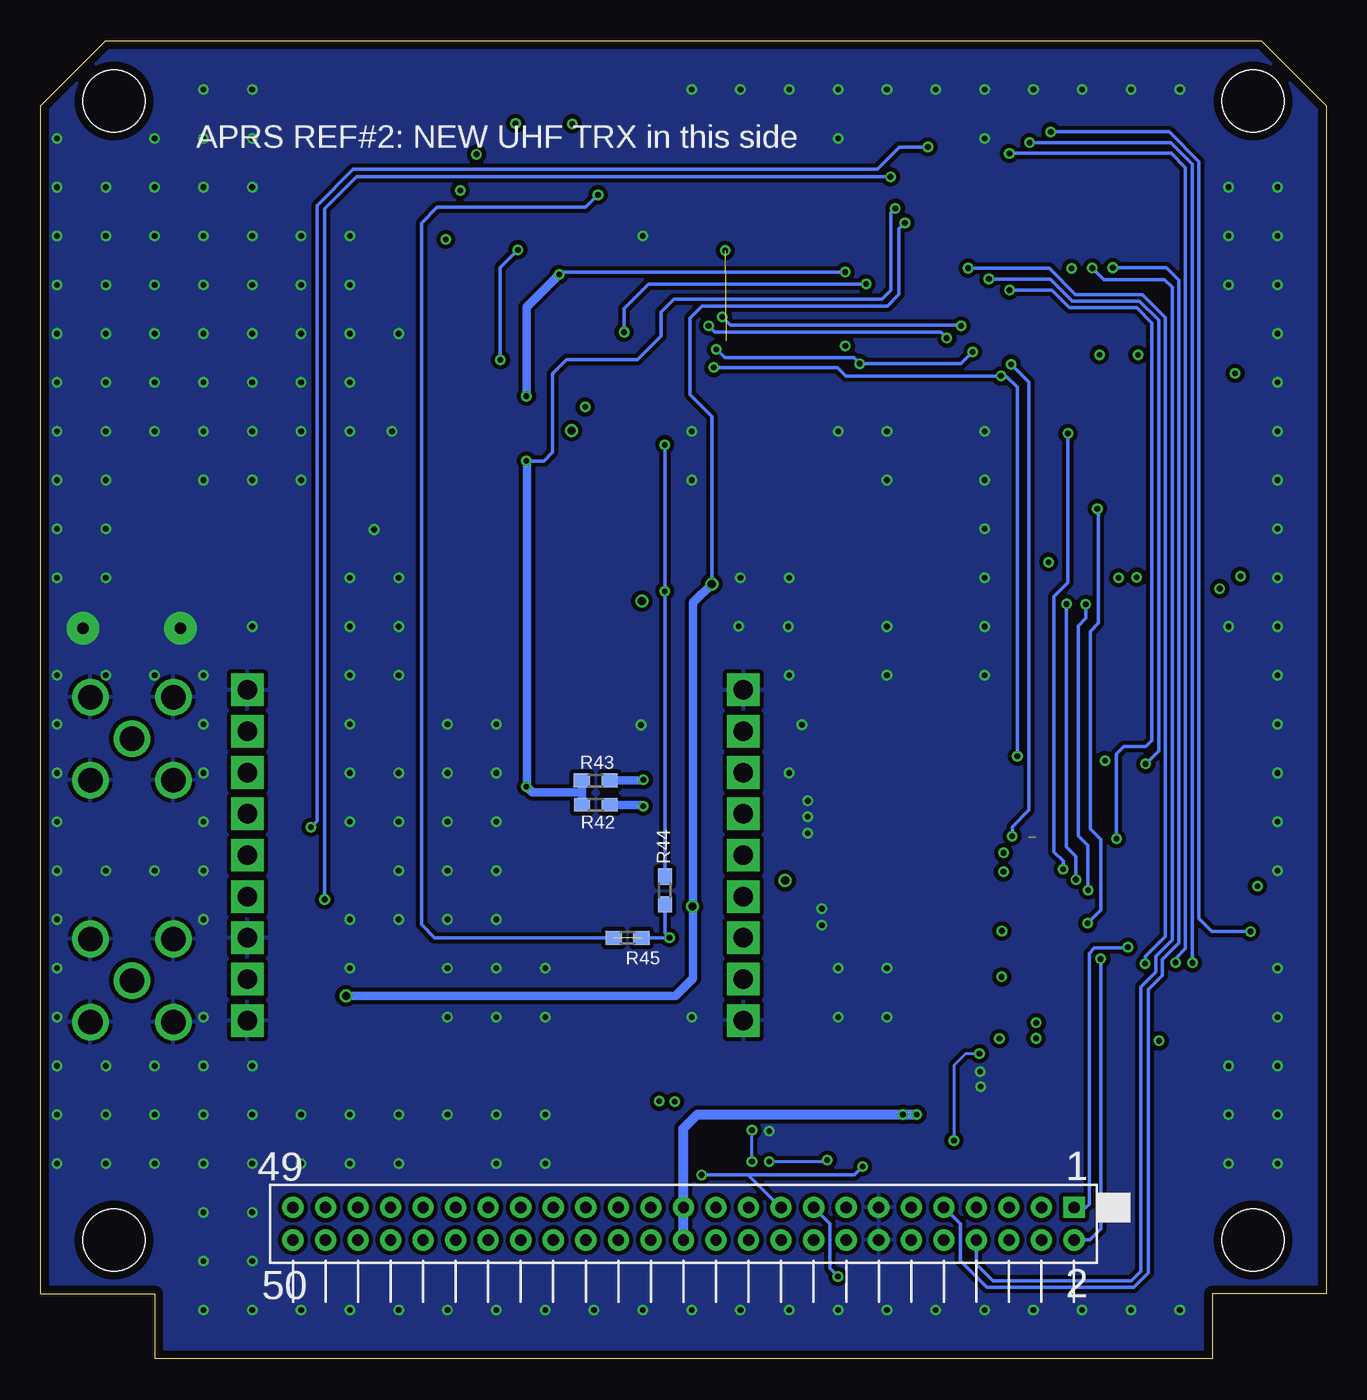
[diagram p5: board, bottom side, seen from below]

Size 79 x 81 mm. Coordinates in mm from the lower left corner, seen from the top.
Outline: 7,0 72,0 72,4 79,4 79,77 75,81 4,81 0,77 0,4 7,4 7,0
Copper layers (1+2*15+16): Top 0.018mm / dielectric 0.25mm / Route2 0.035mm / dielectric 1mm / Route15 0.035mm / dielectric 0.25mm / Bottom 0.018mm
Design rules "default": minimum track width 5mil, minimum drill 0.3mm, track to track 5mil, track to pad 0.229mm, pad to pad 5mil, via to via 5mil, smd to smd 5mil, copper to edge 0.5mm, drill to drill 0.5mm, minimum pad ring 0.15mm, minimum via ring 0.15mm, stop-mask expansion 4mil, vias tented up to drill 0.35mm, thermal gap 10mil
Holes 3.8 mm at 4.5,7.3 74.5,7.3 74.5,77.3 4.5,77.3

### Footprints (pad centres in the part's own frame; a part is rotated, then mirrored left to right if it is on the bottom)
SML0603 = smd 0.8 x 0.8: A 0.75,0; C -0.75,0
M(1005)_US(0402) = smd 0.6 x 0.6: 1 -0.55,0; 2 0.55,0
M(2012)_US(0805) = smd 1 x 1.4: 1 -1.1,0; 2 1.1,0
M(1608)_US(0603) = smd 1 x 0.85: 1 -0.85,0; 2 0.85,0
A3B-50PA-2DS(71) = drill 0.7 pad 1.3 square: 1 0,2 | drill 0.7 pad 1.3: 2 0,0; 3 2,2; 4 2,0; 5 4,2; 6 4,0; 7 6,2; 8 6,0; 9 8,2; 10 8,0; 11 10,2; 12 10,0; 13 12,2; 14 12,0; 15 14,2; 16 14,0; 17 16,2; 18 16,0; 19 18,2; 20 18,0; 21 20,2; 22 20,0; 23 22,2; 24 22,0; 25 24,2; 26 24,0; 27 26,2; 28 26,0; 29 28,2; 30 28,0; 31 30,2; 32 30,0; 33 32,2; 34 32,0; 35 34,2; 36 34,0; 37 36,2; 38 36,0; 39 38,2; 40 38,0; 41 40,2; 42 40,0; 43 42,2; 44 42,0; 45 44,2; 46 44,0; 47 46,2; 48 46,0; 49 48,2; 50 48,0
SOIC127P1032X265-16N = smd 1.925 x 0.7: 1 -4.712,4.445; 2 -4.712,3.175; 3 -4.712,1.905; 4 -4.712,0.635; 5 -4.712,-0.635; 6 -4.712,-1.905; 7 -4.712,-3.175; 8 -4.712,-4.445; 9 4.712,-4.445; 10 4.712,-3.175; 11 4.712,-1.905; 12 4.712,-0.635; 13 4.712,0.635; 14 4.712,1.905; 15 4.712,3.175; 16 4.712,4.445
RAB_ACCESS = smd 2.2 x 0.76: P$1 -0.15,-0.635; P$2 3.55,-0.635; P$3 -0.15,-1.905; P$4 3.55,-1.905; P$5 -0.15,-3.175; P$6 3.55,-3.175; P$7 -0.15,-4.445; P$8 3.55,-4.445; P$9 -0.15,-5.715; P$10 3.55,-5.715; P$11 -0.15,-6.985; P$12 3.55,-6.985; P$13 -0.15,-8.255; P$14 3.55,-8.255; P$15 -0.15,-9.525; P$16 3.55,-9.525; P$17 -0.15,-10.795; P$18 3.55,-10.795; P$19 -0.15,-12.065; P$20 3.55,-12.065; P$21 -0.15,-13.335; P$22 3.55,-13.335; P$23 -0.15,-14.605; P$24 3.55,-14.605
QFP80P1200X1200X120-44N = smd 1.5 x 0.5: 1 -5.9,4; 2 -5.9,3.2; 3 -5.9,2.4; 4 -5.9,1.6; 5 -5.9,0.8; 6 -5.9,0; 7 -5.9,-0.8; 8 -5.9,-1.6; 9 -5.9,-2.4; 10 -5.9,-3.2; 11 -5.9,-4; 23 5.9,-4; 24 5.9,-3.2; 25 5.9,-2.4; 26 5.9,-1.6; 27 5.9,-0.8; 28 5.9,0; 29 5.9,0.8; 30 5.9,1.6; 31 5.9,2.4; 32 5.9,3.2; 33 5.9,4 | smd 0.5 x 1.5: 12 -4,-5.9; 13 -3.2,-5.9; 14 -2.4,-5.9; 15 -1.6,-5.9; 16 -0.8,-5.9; 17 0,-5.9; 18 0.8,-5.9; 19 1.6,-5.9; 20 2.4,-5.9; 21 3.2,-5.9; 22 4,-5.9; 34 4,5.9; 35 3.2,5.9; 36 2.4,5.9; 37 1.6,5.9; 38 0.8,5.9; 39 0,5.9; 40 -0.8,5.9; 41 -1.6,5.9; 42 -2.4,5.9; 43 -3.2,5.9; 44 -4,5.9
QFP50P1200X1200X120-64N = smd 1.475 x 0.3: 1 -5.738,3.75; 2 -5.738,3.25; 3 -5.738,2.75; 4 -5.738,2.25; 5 -5.738,1.75; 6 -5.738,1.25; 7 -5.738,0.75; 8 -5.738,0.25; 9 -5.738,-0.25; 10 -5.738,-0.75; 11 -5.738,-1.25; 12 -5.738,-1.75; 13 -5.738,-2.25; 14 -5.738,-2.75; 15 -5.738,-3.25; 16 -5.738,-3.75; 33 5.738,-3.75; 34 5.738,-3.25; 35 5.738,-2.75; 36 5.738,-2.25; 37 5.738,-1.75; 38 5.738,-1.25; 39 5.738,-0.75; 40 5.738,-0.25; 41 5.738,0.25; 42 5.738,0.75; 43 5.738,1.25; 44 5.738,1.75; 45 5.738,2.25; 46 5.738,2.75; 47 5.738,3.25; 48 5.738,3.75 | smd 0.3 x 1.475: 17 -3.75,-5.738; 18 -3.25,-5.738; 19 -2.75,-5.738; 20 -2.25,-5.738; 21 -1.75,-5.738; 22 -1.25,-5.738; 23 -0.75,-5.738; 24 -0.25,-5.738; 25 0.25,-5.738; 26 0.75,-5.738; 27 1.25,-5.738; 28 1.75,-5.738; 29 2.25,-5.738; 30 2.75,-5.738; 31 3.25,-5.738; 32 3.75,-5.738; 49 3.75,5.738; 50 3.25,5.738; 51 2.75,5.738; 52 2.25,5.738; 53 1.75,5.738; 54 1.25,5.738; 55 0.75,5.738; 56 0.25,5.738; 57 -0.25,5.738; 58 -0.75,5.738; 59 -1.25,5.738; 60 -1.75,5.738; 61 -2.25,5.738; 62 -2.75,5.738; 63 -3.25,5.738; 64 -3.75,5.738
CONMCX001-ND = drill 1.5: 1 0,0; 2 -2.55,-2.55; 3 2.55,-2.55; 4 2.55,2.55; 5 -2.55,2.55
SOT65P210X110-6N = smd 1.05 x 0.4: 1 -1.05,0.65; 2 -1.05,0; 3 -1.05,-0.65; 4 1.05,-0.65; 5 1.05,0; 6 1.05,0.65
BIRDS5_LTC4361 = smd 0.25 x 0.7: 1 -0.675,-0.925; 2 -0.225,-0.925; 3 0.225,-0.925; 4 0.675,-0.925; 5 0.675,0.925; 6 0.225,0.925; 7 -0.225,0.925; 8 -0.675,0.925 | smd 1.37 x 0.54: 9 0,0
SO08 = smd 0.6 x 2.2: 1 -1.905,-2.6; 2 -0.635,-2.6; 3 0.635,-2.6; 4 1.905,-2.6; 5 1.905,2.6; 6 0.635,2.6; 7 -0.635,2.6; 8 -1.905,2.6
SOT346-R = smd 0.7 x 0.9: 1 0.95,-1.05; 2 -0.95,-1.05; 3 0,1.05
TRIM_PVG3A200C01R00 = smd 1.1 x 0.9: 1 1.15,-1.65; 3 -1.15,-1.65 | smd 1.4 x 0.9: 2 0,1.65
CHIPLED_0603 = smd 0.8 x 0.8: A 0,-0.75; C 0,0.75
BIM1H = drill 1.2 pad 2 square: P$1 1.27,21.59; P$2 1.27,19.05; P$3 1.27,16.51; P$4 1.27,13.97; P$5 1.27,11.43; P$6 1.27,8.89; P$7 1.27,6.35; P$8 1.27,3.81; P$9 1.27,1.27; P$10 31.75,1.27; P$11 31.75,3.81; P$12 31.75,6.35; P$13 31.75,8.89; P$14 31.75,11.43; P$15 31.75,13.97; P$16 31.75,16.51; P$17 31.75,19.05; P$18 31.75,21.59
DORJI_DRA818V = smd 1.88 x 2.47: 1 -13.35,8.825; 2 -8.9,8.825; 3 -4.45,8.825; 4 0,8.825; 5 4.45,8.825; 6 8.9,8.825; 7 13.35,8.825; 12 13.35,-8.825; 13 8.9,-8.825; 14 4.45,-8.825; 15 0,-8.825; 16 -4.45,-8.825; 17 -8.9,-8.825; 18 -13.35,-8.825 | smd 2.47 x 1.88: 8 17.125,6.9; 9 17.125,2.3; 10 17.125,-2.3; 11 17.125,-6.9 | smd 1.8 x 6.6: P2 -17.125,6.2 | smd 1.8 x 8: P3 -17.125,-5.5
SOT65P210X110-5N = smd 1.168 x 0.356: 1 -0.965,0.66; 2 -0.965,0; 3 -0.965,-0.66; 4 0.965,-0.66; 5 0.965,0.66
CRYSTAL_SM49 = smd 5.08 x 1.778: 1 -4.826,0; 2 4.826,0
SM49 = smd 5.08 x 1.778: 1 -4.826,0; 2 4.826,0

### Placement (x,y rotation side)
APD1  60.26,71.74 180 top
APD2  60.3,73.68 180 top
APD3  60.26,75.74 180 top
APD4  60.26,77.74 180 top
C1  18.4,18.62 0 top
C2  36.76,13.39 270 top
C3  18.93,17.19 0 top
C4  20.89,40.04 270 top
C5  4.62,40.01 270 top
C6  14.13,35.86 0 top
C7  12.87,19.29 270 top
C8  20.37,29.03 0 top
C9  20.5,24.44 0 top
C10  20.48,25.45 0 top
C11  3.65,28.04 180 top
C12  8.38,47.54 270 top
C13  70.95,46.83 180 top
C14  65.47,51.56 90 top
C15  68.56,51.59 90 top
C16  71.56,51.58 90 top
C17  28.68,62.79 90 top
C18  53.44,65.99 270 top
C19  54.53,65.98 270 top
C20  45.78,74.96 180 top
C21  37.94,68.63 90 top
C22  46.08,59.54 0 top
C23  33.66,57.94 0 top
C24  33.65,74.28 0 top
C25  52.4,59.66 0 top
C26  49.15,57.35 270 top
C27  31.79,22.75 270 top
C28  32.82,22.76 270 top
C29  32.02,29.96 90 top
C30  28.31,39.39 270 top
C31  26.63,40.18 0 top
C32  28.29,44.89 270 top
C33  31.95,53.91 90 top
C34  35.27,53.94 90 top
C35  21.17,32.06 0 top
CN1  15.5,7.3 0 top
FM_SF  11.55,54.92 90 top
JP1  9.94,68.84 90 top
L1  73.41,47.86 90 top
L2  70.46,49.01 180 top
L3  66.6,49 180 top
L4  55.92,67.68 270 top
MCU_APRS  45.54,67.34 0 top
MCU_SF  12.11,28.32 90 top
MCX  73.4,38.11 90 top
MCX1  73.4,23.25 0 top
MOS1  35.71,16.48 180 top
MOS2  18.88,14.33 0 top
OCP1  32.53,13.06 0 top
OCP2  22.83,17.83 180 top
OPAMP1  28.93,32.85 180 top
Q1  39.68,44.65 180 top
Q2  39.35,13.33 0 top
Q3  42.91,13.31 0 top
Q4  26.44,12.75 90 top
R1  42.25,49.51 270 top
R2  30.67,13.65 90 top
R3  31.76,15.86 0 top
R4  23.97,13.04 90 top
R5  22.83,15.01 180 top
R6  14.63,19.77 90 top
R7  15.62,19.78 90 top
R8  50.65,58.82 270 top
R9  15.44,61.69 0 top
R10  10.17,48.04 180 top
R11  16.53,48 180 top
R12  8.96,61.69 180 top
R13  14.21,48 0 top
R14  6.55,61.7 0 top
R15  5.26,49.7 90 top
R16  10.81,20.44 0 top
R17  9.67,17.25 90 top
R18  49.27,75.03 0 top
R19  53.22,70.18 90 top
R20  51.5,56.66 180 top
R21  57.26,71.74 0 top
R22  57.26,73.74 0 top
R23  57.26,75.74 0 top
R24  57.26,77.74 0 top
R25  52.22,75.99 270 top
R26  50.97,75.98 90 top
R27  33.51,39.39 270 top
R28  25.99,27.61 270 top
R29  28.29,27.65 90 top
R30  27.01,27.62 90 top
R31  26.14,38.61 0 top
R32  28.3,42.2 90 top
R33  28.28,48.52 180 top
R34  30.29,52.13 0 top
R35  33.59,52.14 0 top
R36  36.92,52.13 0 top
R37  25.35,32.94 270 top
R38  25.34,36.1 270 top
R39  38.94,30.1 90 top
R40  37.76,49.8 90 top
R41  35.24,50.65 0 top
R42  44.89,34.05 0 bottom
R43  44.9,35.53 0 bottom
R44  40.64,28.77 90 bottom
R45  42.94,25.87 180 bottom
SFD1  9.68,14.22 180 top
TRX1  67.57,42.38 180 top
TRX2  53.79,35.67 90 top
U1  26.43,61.57 0 top
U2  19.94,34.42 270 top
XTAL1  12.76,40.58 180 top
XTAL2  33.11,66.09 90 top

### Tracks (layer width: path | path; a pad name or v marks a point on that pad's centre or on a via)
APRS_AFIN  (via drill 0.35)
  Top 0.203: JP1.P$11 16.92,65.89 18.37,64.44 26.43,64.44 27.32,65.33 28.82,65.33 29.12,65.63 29.12,66.49 29.41,66.78 v29.57,66.78
  Top 0.406: 49.15,59.14 C26.1 49.22,57.97 R8.2
  Top 0.508: v49.15,59.16 v49.16,59.15 49.15,59.14 | MCU_APRS.37 v47.14,66.63 | R8.2 R20.2
  Bottom 0.203: v47.14,66.63 46.99,66.78 v29.57,66.78
  Bottom 0.508: v49.15,59.16 49.15,64.63 v47.15,66.63 v47.14,66.63
APRS_AFOUT  (via drill 0.35)
  Top 0.203: JP1.P$13 18.19,65.67 18.91,64.95 26.18,64.95 27.28,66.05 v28.28,66.05 | v43.15,63.09 MCU_APRS.14
  Top 0.508: MCU_APRS.14 43.14,54.7 40.56,52.12 R36.2 | R36.2 R40.2 R41.2 | R36.2
  Bottom 0.203: v28.28,66.05 41.64,66.05 43.15,64.54 v43.15,63.09
APRS_TO_MB  (via drill 0.35)
  Top 0.203: v18.23,74.73 18.23,72.42 JP1.P$14 | v8.22,24.33 8.36,24.19 MCU_SF.1 8.36,5.55 10.03,3.88 29.81,3.88 31.5,5.57 CN1.18
  Bottom 0.203: v8.22,24.33 v8.23,24.34 8.23,73.41 9.55,74.74 v18.22,74.74 v18.23,74.73
APRS_XTAL1
  Top 0.203: 33.11,61.5 XTAL2.1 C23.1
  Top 0.305: MCU_APRS.8 34.4,65.74 33.11,64.45 33.11,61.5
APRS_XTAL2
  Top 0.203: 33.11,69.95 33.11,70.38 | 33.11,70.38 XTAL2.2 | 33.16,67.72 33.11,67.77 | C24.1 33.1,70.39 33.11,70.38
  Top 0.305: MCU_APRS.7 34.34,66.54 33.16,67.72 | 33.11,67.77 33.11,69.95
APRSDP_5V0  (via drill 0.35, 0.5)  (1 unrouted)
  Top 0.18: OCP1.3 32.76,11.52 32.99,11.29 34.99,11.29 35.29,11.59 v35.29,12.13 | C2.1 35.73,14.49 v35.29,14.05
  Top 0.203: MCU_APRS.5 39.58,68.08 C21.1 36.95,68.08 v36.93,68.1 | MCU_APRS.38 C20.1 v46.33,75.89 | L4.1 v54.11,68.78 v54.1,68.79 | MCU_APRS.17 C22.1 v45.54,58.49 | R18.2 v49.82,75.91 | R19.2 v53.22,71.8 | R25.2 v52.22,74.02 | R28.2 25.41,27.06 25.18,27.29 25.18,28.65 25.46,28.93 26.01,28.93 26.28,29.2 26.28,31.53 26.66,31.91 30.45,31.91 30.84,31.52 OPAMP1.8 30.84,29.64 31.06,29.41 C29.1 32.04,29.39 v33.25,29.39 | U1.5 C17.1 v29.55,62.24
  Top 0.406: C2.1 MOS1.1 40.02,15.84 v40.04,15.81 40.06,15.83 v40.99,15.83 | TRX2.8 46.38,53.31 v46.38,57.04 | TRX2.6 42.77,44.58 42.06,45.29 v42.06,46.56
  Top 0.508: C27.1 31.81,23.32 C28.1 TRX1.P$17
  Route15 0.203: v29.55,62.24 36.52,62.24 36.86,62.58
  Route15 0.406: TRX1.P$17
  Route15 0.508: 45.09,44.59 42.76,44.59 42.06,45.29 v42.06,46.56
  Bottom 0.18: v35.29,12.13 v35.29,14.05
  pour Route15 (isolate 0.406): 39.5,17 44.5,17 44.5,60 37.5,60 36.5,61 36.5,75 38,76.5 53,76.5 54.5,75 54.5,66.3 48.2,60 47.5,60 47.5,14.5 39.5,14.5
  pour Route15 (isolate 0.406): 44.5,22 32,22 32,31.5 34,31.5 34,24.5 44.5,24.5
APSF_MCU_RXB  (via drill 0.35)
  Top 0.203: U1.2 24.36,61.57 23.9,61.11 v19.37,61.11 | v19.3,32.11 18.76,31.57 MCU_SF.31
  Bottom 0.203: v19.3,32.11 19.3,32.68 18.27,33.71 18.27,60.02 v19.37,61.11
APSF_MCU_TXB  (1 unrouted)
  Top 0.203: 19.28,33.08 U2.4 19.28,33.17 18.17,32.07 18.27,32.07
AREF  (via drill 0.35)
  Top 0.203: MCU_APRS.29 v49.68,68.14 v49.67,68.15 | R8.1 50.75,59.77 v50.75,61.39
  Top 0.406: C25.1 R8.1
  Bottom 0.203: v49.67,68.15 50.76,67.06 v50.76,61.4 v50.75,61.39
AVCC
  Top 0.203: MCU_APRS.27 C18.1 C19.1 54.58,66.58 L4.2
DEBUG  (via drill 0.35)
  Top 0.203: MCU_SF.60 4.97,26.57 v4.66,26.26 | v16.93,75.4 JP1.P$12
  Bottom 0.203: v4.66,26.26 7.03,26.26 7.82,27.05 7.82,73.58 9.65,75.4 v16.92,75.4 v16.93,75.4
FM_RESET
  Top 0.203: R10.2 9.62,50.19 FM_SF.3
FM_W#
  Top 0.203: FM_SF.9 16,61.68 R9.2
GATE3
  Top 0.18: OCP2.6 22.61,16.31 22.33,16.03 19.31,16.03 19.01,15.73 19.01,14.56 18.78,14.33 MOS2.2
GND  (via drill 0.35, 0.7 pad 2)
  Top 0.18: OCP1.1 31.86,11.13
  Top 0.203: 12.36,24.02 MCU_SF.9 12.36,21.34 | 5.13,28.57 MCU_SF.56 7.85,28.57 | 19.02,28.57 MCU_SF.25 16.64,28.57 | 19.08,26.07 MCU_SF.20 16.68,26.07 | 11.86,35.29 MCU_SF.41 11.86,32.91
  Top 0.406: MCU_APRS.39 45.54,74.29 45.23,74.6 C20.2
  other vias: 21.25,16.73 21.27,17.66 31.87,32.3 3,12 6,12 6,15 3,15 3,18 6,18 27,21 27,24 30,24 30,21 51,24 48,24 54,24 51,30 51,33 51,36 54,36 54,33 57,33 57,36 54,39 51,39 54,30 57,30 60,33 60,36 60,39 60,42 60,45 57,45 57,12 60,12 63,12 66,12 69,12 72,12 75,12 75,15 72,15 69,15 66,15 63,15 60,15 60,66 63,66 66,66 69,66 69,69 66,69 63,69 60,69 60,60 63,60 66,60 69,60 69,63 66,63 63,63 60,63 75,57 75,60 75,63 75,66 72,66 72,63 72,60 72,57 75,69 75,72 72,75 72,72 72,69 69,72 69,75 69,78 66,78 66,75 66,72 57,42 60,48 57,48 42.11,38.95 33,36 32.22,38.96 33,42 33.07,45 33,48 36,48 27,45 27,42 21,42 21,45 21,48 21,51 21,54 21,57 27,57 27,54 30,57 39,54 39,57 42,69 75,54 75,51 75,48 76.4,44.9 75,42 78,42 78,48 78,51 78,54 78,57 78,60 78,63 78,66 78,69 78,72 78,75 57,63 57.41,56.99 39,78 36,78 33,78 30,78 27,78 24,78 21,78 18,78 15,78 12,78 9,78 21,75 30,75 6,72 6,69 6,66 3,66 3,69 3,72 3,63 3,60 3,57 3,54 3,51 3,48 3,45 6,45 3,42 3,39 3,36 3,33 3,30 3,24 3,21 75,18 72,18 69,18 66,18 9,3 12,3 15,3 18,3 21,3 24,3 27,3 30,3 33,3 36,3 39,3 42,3 45,3 48,3 51,3 54,3 57,3 60,3 63,3 66,3 69,3 69,6 66,6 66,9 69,9 78,12 78,15 78,18 78,24 78,21 78,30 78,27 75,30 72,30 69,30 78,33 78,36 78,39 72,42 69,42 66,45 69,27 69,33 69,36 69,39 69,21 51,12 48,12 48,15 51,15 54,15 57,15 39,21 58.51,50.96 63,54 66,54 69,54 69,57 66,57 63,57 60,57 51,27 54,27 57,27 60,27 60,24 48,21 51,21 54,21 31.86,34.28 31.87,33.3 31,27.66 31,26.64 34.23,14 70.4,44.9 36.1,45.02
  pour Top (isolate 0.254): -1,-1 -1,82 13,82 80,82 80,76 80,-1
  pour Route2 (isolate 0.254): -2,-2 81,-2 81,-1 81,83 79,83 -2,83
  pour Route15 (isolate 0.406, rank 6): -3,-3 -3,84 8,84 82,84 82,-3
  pour Bottom (isolate 0.254): -4,-4 83,-4 83,24 83,85 -4,85
HOLD
  Top 0.203: R15.2 7.06,50.25 FM_SF.1
LED
  Top 0.203: MCU_SF.3 9.36,18.41 R17.2
LED2_GREEN
  Top 0.203: R22.2 59.49,73.74 APD2.A
LED2_GRN
  Top 0.203: MCU_APRS.41 43.94,74.33 43.75,74.52 43.75,77.69 44.46,78.4 52.89,78.4 53.68,77.61 53.68,74.75 54.69,73.74 R22.1
LED3_YLW
  Top 0.203: MCU_APRS.42 43.14,77.67 44.27,78.8 53.13,78.8 54.14,77.79 54.14,76.69 55.09,75.74 R23.1
LED4_BLU
  Top 0.203: MCU_APRS.43 42.34,75.37 42.34,77.52 44.06,79.24 53.34,79.24 54.84,77.74 R24.1
LED4_BLUE
  Top 0.203: R24.2 APD4.A
LED_3_YELLOW
  Top 0.203: R23.2 APD3.A
MB_DIO_APRSDP_5V0
  Top 0.203: Q3.2 41.96,10.8 42.48,10.28 42.48,5.9 41.47,4.89 34.42,4.89 33.5,5.81 CN1.20
MB_DIO_SFWARD_3V3  (via drill 0.35)
  Top 0.18: Q4.2 28.48,11.8 v28.49,11.81 | v38.39,11.3 38.39,12.27 Q2.2
  Bottom 0.18: v38.39,11.3 v38.38,11.3
  Bottom 0.203: 35.53,11.3 33.53,9.3 CN1.19 | v28.49,11.81 29,11.3 35.53,11.3 | 35.53,11.3 v38.39,11.3
MB_TO_APRS  (via drill 0.35)
  Top 0.203: v9.25,24.36 8.86,23.96 MCU_SF.2 8.86,5.84 10.34,4.37 29.32,4.37 v30.01,5.06 | v19.47,74.08 19.47,72.4 JP1.P$16
  Bottom 0.203: v9.25,24.36 9.25,24.61 8.66,25.21 8.66,73.21 9.53,74.08 v19.47,74.08 | CN1.17 30.51,8.31 30.51,5.56 v30.01,5.06
MCLR  (via drill 0.35)
  Top 0.203: CN1.3 17.5,10.99 16.65,11.84 11.96,11.84 11.36,12.44 11.36,20.1 | 11.36,20.1 MCU_SF.7 11.36,24.06 v11.13,24.29 | R16.2 11.36,20.1 | v22.01,67.02 JP1.P$19
  Bottom 0.203: v11.13,24.29 11.13,24.71 9.89,25.95 9.89,63.99 11.31,65.41 15.42,65.41 17.03,67.02 v22.01,67.02
N$1
  Top 0.18: OCP1.6 32.76,14.57 33,14.81 35.43,14.81 35.7,15.07 35.7,16.23 35.95,16.48 MOS1.2
N$2
  Top 0.203: MCU_SF.10 12.86,20.15 C7.1
N$3
  Top 0.18: XTAL1.2 4.64,40.58 C5.1
  Top 0.203: XTAL1.2 11.12,40.58 12.36,39.34 MCU_SF.40
N$4
  Top 0.203: MCU_SF.15 15.36,21.05 15.62,20.78 R7.2
N$5
  Top 0.203: MCU_SF.14 14.86,21.02 14.63,20.79 R6.2
N$6
  Top 0.203: SFD1.A R17.1
N$7
  Top 0.508: L3.1 68.21,48.99 | 68.21,48.99 69.35,48.99 L2.2 | C15.1 68.56,49.34 68.21,48.99
N$8
  Top 0.508: C16.1 L2.1 73.36,49.01 L1.2
N$10
  Top 0.508: C13.1 73.34,46.83 arc-90 L1.1 | 73.4,46.75 L1.1 | L1.1 73.41,38.12 MCX.1
N$12
  Top 0.203: TRX2.7 44.9,48.96 R1.2
N$13
  Top 0.203: MCU_APRS.35 48.72,73.26 R18.1
N$14
  Top 0.203: MCU_APRS.30 53,68.94 53.22,69.16 R19.1
N$15
  Top 0.203: TRX1.P$11 33.54,38.57 R27.2
N$16
  Top 0.508: MCX1.1 73.32,23.33 TRX1.P$2
N$17
  Top 0.203: R28.1 R30.2 27.01,30.23 OPAMP1.5
N$19
  Top 0.508: R32.2 C32.2
N$20
  Top 0.508: C31.2 28.31,40.19 C30.1 R32.1
N$21
  Top 0.508: OPAMP1.3 28.3,38.54 | 28.3,38.54 28.3,38.83 C30.2 | R31.2 28.23,38.61 28.3,38.54
N$22
  Top 0.203: TRX2.5 40.51,40.12 39.68,40.96 Q1.3
N$23
  Top 0.508: C32.1 R33.2
N$24
  Top 0.508: R34.1 R33.3 29.43,50.42 29.66,50.65 R41.1
N$25
  Top 0.508: R35.2 35.18,52.14 | 35.18,52.14 R36.1 | C34.1 35.27,52.23 35.18,52.14
N$26
  Top 0.508: R34.2 31.81,52.14 | 31.81,52.14 R35.1 | C33.1 31.95,52.28 31.81,52.14
N$27
  Top 0.203: R38.2 R37.1 25.71,33.43 29.09,33.43 29.57,33.91 OPAMP1.2
ON3  (via drill 0.35)
  Top 0.18: OCP2.4 v21.31,18.75
  Top 0.203: Q4.3 25.39,12.66 25.22,12.49 R4.1 23.17,12.49 22.88,12.78 v22.88,13.42
  Bottom 0.18: v21.31,18.75 22.17,18.75 22.88,18.04 v22.88,13.42
ON4  (via drill 0.35)
  Top 0.18: OCP1.4 v34.23,12.12 34.23,12.73 34.84,13.34 37.47,13.34 37.81,13.67 37.81,14.16 38.03,14.38 Q2.3 39.37,14.36 Q3.3 | R2.1 v30.67,12.22 v30.66,12.21
  Bottom 0.18: v34.23,12.12 34.21,12.13 30.74,12.13 v30.66,12.21
OSC2
  Top 0.18: C4.1 17.6,40.59 XTAL1.1
  Top 0.203: MCU_SF.39 12.86,39.32 14.12,40.58 XTAL1.1
PA1
  Top 0.203: MCU_APRS.36 47.94,75.95 48.82,76.83 R26.2 R25.1
PD0_RXA  (via drill 0.35)
  Top 0.203: JP1.P$7 v14.38,67.03 14.38,65.27 15,64.65 17.13,64.65 18.42,63.36 22.33,63.36 v22.44,63.47 | v37.11,64.02 37.11,64.34 37.72,64.95 MCU_APRS.9
  Bottom 0.203: CN1.8 21.5,5.81 20.48,4.79 11.98,4.79 11.4,5.38 11.4,22.86 10.47,23.79 10.47,24.73 9.47,25.74 9.47,65.84 9.94,66.31 13.67,66.31 v14.38,67.03 | v37.11,64.02 36.62,63.53 22.5,63.53 v22.44,63.47
PD1_TXA  (via drill 0.35)
  Top 0.203: JP1.P$5 v13.11,67.05 13.11,65.08 13.95,64.24 16.91,64.24 18.43,62.72 v23.32,62.72 | MCU_APRS.10 38.37,64.14 37.96,63.73 v37.96,63.48
  Bottom 0.203: CN1.9 22.5,8.3 22.5,6.04 20.85,4.39 11.81,4.39 10.92,5.28 10.92,22.71 10.07,23.56 10.07,24.55 9.06,25.55 9.06,66.29 9.83,67.05 v13.11,67.05 | v37.96,63.48 v37.95,63.48 37.55,63.08 23.68,63.08 v23.32,62.72
PGC  (via drill 0.35)
  Top 0.203: v12.19,25.3 12.02,25.3 11.36,25.96 MCU_SF.42 11.36,36.3 v11.1,36.56 | v20.73,66.36 JP1.P$17
  Bottom 0.203: CN1.1 14.76,9.3 14.56,9.5 14.56,24.92 14.24,25.24 12.19,25.24 v12.19,25.3 | v11.1,36.56 10.3,37.35 10.3,63.83 11.48,65 15.61,65 16.97,66.36 v20.73,66.36
PGD  (via drill 0.35)
  Top 0.203: v13.86,24.58 MCU_SF.37 13.86,32.48 13.34,31.97 v12.89,31.97 | JP1.P$15 v19.46,65.68 v19.47,65.67
  Bottom 0.203: CN1.2 14.54,7.3 13.86,7.98 v13.86,24.58 | v12.89,31.97 12.89,37.17 12.44,37.62 11.09,37.62 10.71,38.01 10.71,63.66 11.64,64.6 15.78,64.6 16.86,65.67 v19.47,65.67
PTT  (via drill 0.35)
  Top 0.203: v40.65,47.17 40.65,45.72 Q1.2 | v40.65,56.17 40.65,58.18 42.34,59.87 MCU_APRS.13
  Bottom 0.203: v40.65,56.17 v40.65,47.17 R44.2
RF_TRX
  Top 0.508: TRX2.12 65.48,49.02 L3.2 65.5,50.69 C14.1
RFOUT  (via drill 0.35)
  Top 0.508: v41.97,33.96 41.5,33.49 TRX1.P$13
  Bottom 0.508: R42.2 42.06,34.05 v41.97,33.96
RXD  (via drill 0.35)
  Top 0.508: TRX1.P$12 41.52,36.03 v41.96,35.59
  Bottom 0.508: R43.2 42.02,35.53 v41.96,35.59
SENSE3
  Top 0.18: OCP2.7 23.06,15.9 22.17,15.01 R5.2
  Top 0.406: MOS2.6 R5.2
SENSE4
  Top 0.18: R3.2 32.31,15.31 OCP1.7
  Top 0.406: MOS1.6 32.88,15.84 R3.2
SFWARD_3V3_2  (via drill 0.35)
  Top 0.18: OCP2.3 22.6,19.23 22.16,19.67 v20.09,19.67
  Top 0.203: MCU_SF.26 19.78,29.07 C8.1 19.82,29.91 v19.84,29.93 | MCU_SF.19 19.81,25.57 C10.1 v19.93,26.28 v19.93,26.29 | MCU_SF.17 19.82,24.57 C9.1 19.95,23.49 v19.94,23.48 | MCU_SF.57 4.22,28.07 C11.1 4.2,29.01 v4.23,29.05 | MCU_SF.38 13.36,35.64 C6.1 13.58,36.74 v13.6,36.76 | R16.1 v10.26,19.55 v10.27,19.54 | FM_SF.2 C12.1 7.03,48.09 6.55,47.61 v6.55,47.33 | R10.1 v11.64,48.04 v11.65,48.03 | R13.1 12.77,48 v12.76,47.99 | v17.07,48.95 17.07,48.02 R11.1 | R14.1 5.6,61.3 v5.6,60.55 | R12.1 11.56,61.69 v11.57,61.7 | R9.1 v13.95,61.69 v13.94,61.7 | R15.1 v5.26,48.1 v5.27,48.09 | v19.83,31.09 19.83,31.68 20.21,32.06 C35.1 20.6,32.08 U2.5
  Top 0.406: MOS2.1 17.82,14.99 C3.1 17.82,18.6 C1.1 17.85,19.68 v17.83,19.69 17.83,20.64 v17.82,20.65 | JP1.P$9 v15.65,67
  Route15 0.406: v15.65,67 15.65,62.35 15.01,61.7 v13.94,61.7
  pour Route15 (isolate 0.406): 17,19 20.5,19 20.5,37.5 15,37.5 15,47 19,47 19,62.5 5,62.5 5,59.5 15,59.5 15,50.5 4.5,50.5 4.5,46.5 11,46.5 11,37.5 3.5,37.5 3.5,19 11,19 11,22.5 7,22.5 7,34 16,34 17,34
SPI_FM_CS  (via drill 0.35)
  Top 0.203: FM_SF.7 14.76,50.17 R13.2 14.76,46.38 v14.78,46.37 | MCU_SF.22 15.29,27.07 14.63,27.73 v14.63,28.79 v14.64,28.8
  Bottom 0.203: v14.64,28.8 14.64,31.53 15.23,32.13 15.23,45.03 14.76,45.51 14.76,46.31 14.78,46.32 v14.78,46.37
SPI_MISO  (via drill 0.35)
  Top 0.203: FM_SF.8 16,48.02 R11.2 15.98,46.41 v15.96,46.39 | MCU_SF.23 15.78,27.57 15.38,27.96 v15.38,29.45
  Bottom 0.203: v15.96,46.39 15.96,31.45 15.38,30.88 v15.38,29.45
SPI_MOSI  (via drill 0.35)
  Top 0.203: R12.2 8.38,61.65 FM_SF.15 8.38,57.94 8.89,57.43 15.31,57.43 v15.87,56.87 | MCU_SF.24 16.38,28.07 16.17,28.27 16.17,30.08 v16.16,30.09
  Bottom 0.203: v15.87,56.87 15.87,47.71 16.73,46.85 16.73,31.16 16.16,30.59 v16.16,30.09
SPI_SCK  (via drill 0.35)
  Top 0.203: R14.2 FM_SF.16 7.11,57.4 7.86,56.65 13.68,56.65 14.06,56.26 v14.06,52.24 | MCU_SF.21 14.86,26.57 v14.67,26.76
  Bottom 0.203: v14.06,52.24 14,52.17 14,45.21 14.51,44.7 14.51,32.56 13.86,31.91 13.86,27.58 v14.67,26.76
SUP_3V3_2  (via drill 0.35)
  Top 0.18: OCP2.8 23.51,15.43 R5.1
  Top 0.203: R4.2 23.93,13.63 R5.1
  Top 0.61: v25.16,15.01 | R5.1 v26.02,15.01
  Bottom 0.61: CN1.26 CN1.25 39.5,14.15 38.64,15.01 v26.02,15.01 v25.16,15.01
SUP_5V0
  Top 0.18: R2.2 30.7,14.23 30.65,14.28 29.5,14.28 | OCP1.8 31.86,15.1 31.1,15.86
  Top 0.203: R3.1 31.1,15.86
  Top 0.61: CN1.16 CN1.15 29.5,14.28 29.5,15.35 30.01,15.86 R3.1
TNC_RX  (via drill 0.35)
  Top 0.203: MCU_APRS.11 39.64,62.49 39.18,62.03 v37.48,62.03 | U1.4 28.44,60.91 v28.68,61.15 | JP1.P$3 11.84,64.69 12.75,63.78 16.74,63.78 18.21,62.31 21.3,62.31 v21.73,61.88
  Bottom 0.203: v37.48,62.03 36.96,61.51 29.04,61.51 v28.68,61.15 22.46,61.15 v21.73,61.88
TNC_TX  (via drill 0.35)
  Top 0.203: U2.2 19.94,36.07 v18.98,37.03 | MCU_APRS.12 38.16,61.44 v37.64,60.92 | JP1.P$1 10.57,64.51 11.7,63.38 16.02,63.38 19,60.4 v19.99,60.4
  Bottom 0.203: v18.98,37.03 18.98,59.7 19.68,60.4 v19.99,60.4 29.52,60.4 30.05,60.92 v37.64,60.92
TRX1_AFOUT  (via drill 0.35)
  Top 0.203: JP1.P$10 15.65,70.99 15.89,70.75 26.43,70.75 v26.48,70.7
  Top 0.406: C26.2 v49.15,55.18
  Top 0.508: TRX2.3 47.9,31.23 49.15,32.48 v49.15,35.16
  Bottom 0.203: v49.15,55.18 48.08,55.18 47.54,55.72 47.54,60.55 46.69,61.4 42.33,61.4 40.89,62.84 40.89,64.31 40.07,65.13 27.3,65.13 26.75,65.68 26.75,70.43 v26.48,70.7
  Bottom 0.508: v49.15,55.18 49.12,55.15 49.12,35.19 v49.15,35.16 48.78,34.79 45.74,34.79 | R43.1 45.74,34.79 | 45.74,34.79 R42.1
TRX1_RX_LED
  Top 0.203: R21.2 APD1.A
TRX1_RXSELECT  (via drill 0.35)  (1 unrouted)
  Top 0.203: R21.1 54.5,71.74 53.25,72.99 53.25,77.42 52.67,78 44.7,78 44.29,77.59 44.29,74.68 44.74,74.23 MCU_APRS.40 v44.74,71.54 v44.75,71.53 | TRX1.P$16 35.77,25.91 | OPAMP1.6 R29.2 29.1,28.2 29.57,27.73 29.57,26.49 30.19,25.87 TRX1.P$16 | TRX1.P$16 v40.35,25.87 v40.36,25.88
  Bottom 0.203: v44.75,71.53 45.52,70.76 54.64,70.76 55.6,69.8 55.6,26.68 54.79,25.87 R45.2 | R44.1 40.64,26.16 v40.36,25.88 v40.37,25.87 R45.1
TRX1_TXD
  Top 0.203: R37.2 26.02,32.76 30.09,32.76 30.84,33.51 OPAMP1.1
  Top 0.508: OPAMP1.1 30.93,35.55 31.95,35.55 33.09,34.41 33.09,31.67 33.81,30.95 TRX1.P$14 R39.2
TRX1_TXSELECT
  Top 0.203: OPAMP1.7 29.57,28.78 29.93,28.41 TRX1.P$15
TRX_IN  (via drill 0.35, 0.5)
  Top 0.203: JP1.P$8 14.39,70.68 14.72,70.34 25.35,70.34 v25.89,69.8
  Top 0.508: TRX2.18 60.27,22.32 v60.24,22.3 | R39.1 v38.94,27.8 | R40.1 v37.76,47.62
  Bottom 0.203: v37.76,47.62 37.76,57.89 39.11,59.24 39.11,63.94 38.36,64.69 26.98,64.69 26.25,65.42 26.25,69.44 v25.89,69.8
  Bottom 0.508: v37.76,47.62 38.91,46.47 38.91,27.83 v38.94,27.8 38.91,27.77 38.91,23.37 39.98,22.3 v60.24,22.3
TRX_UART_RXD  (via drill 0.35)
  Top 0.203: TRX2.16 62.4,31.44 v62.4,32.67 | v24.48,74.47 23.57,74.47 23.26,74.16 23.26,72.4 JP1.P$22
  Bottom 0.203: v62.4,32.67 62.02,33.05 62.02,70.87 59.79,73.1 27.59,73.1 26.22,74.47 v24.48,74.47
TRX_UART_TXD  (via drill 0.35)
  Top 0.203: TRX2.17 62.4,26.77 61.55,27.62 v61.55,28.23 | JP1.P$24 24.8,72.64 v26.78,72.64
  Bottom 0.203: v61.55,28.23 61.55,29.1 61.56,29.1 61.56,70.67 59.58,72.65 v26.79,72.65 v26.78,72.64

### Text on the board
tPlace: + | - | PWR | + | - | CAD | + | - | GPS | + | - | PTT
tNames: APRS REF#1: UHF COM Board this side | 2 | 1 | 1 / (TRX2) | 1 / (TRX1) | 1 | 49 | 2 | 50 | BIRDS-X Dragonfly Satellite APRS REF#1 & APRS REF #2 FM / Designed by Tharindu/Ferrer - December/2023
bNames: APRS REF#2: NEW UHF TRX in this side | 1 | 49 | 2 | 50